# EAGLE schematic Doppler_LED_Controller (EAGLE 9.1.3)
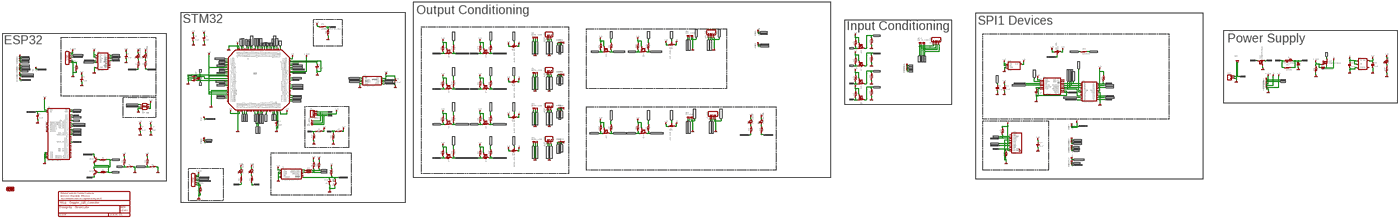
[diagram p0: schematic, sheet 1, overview]
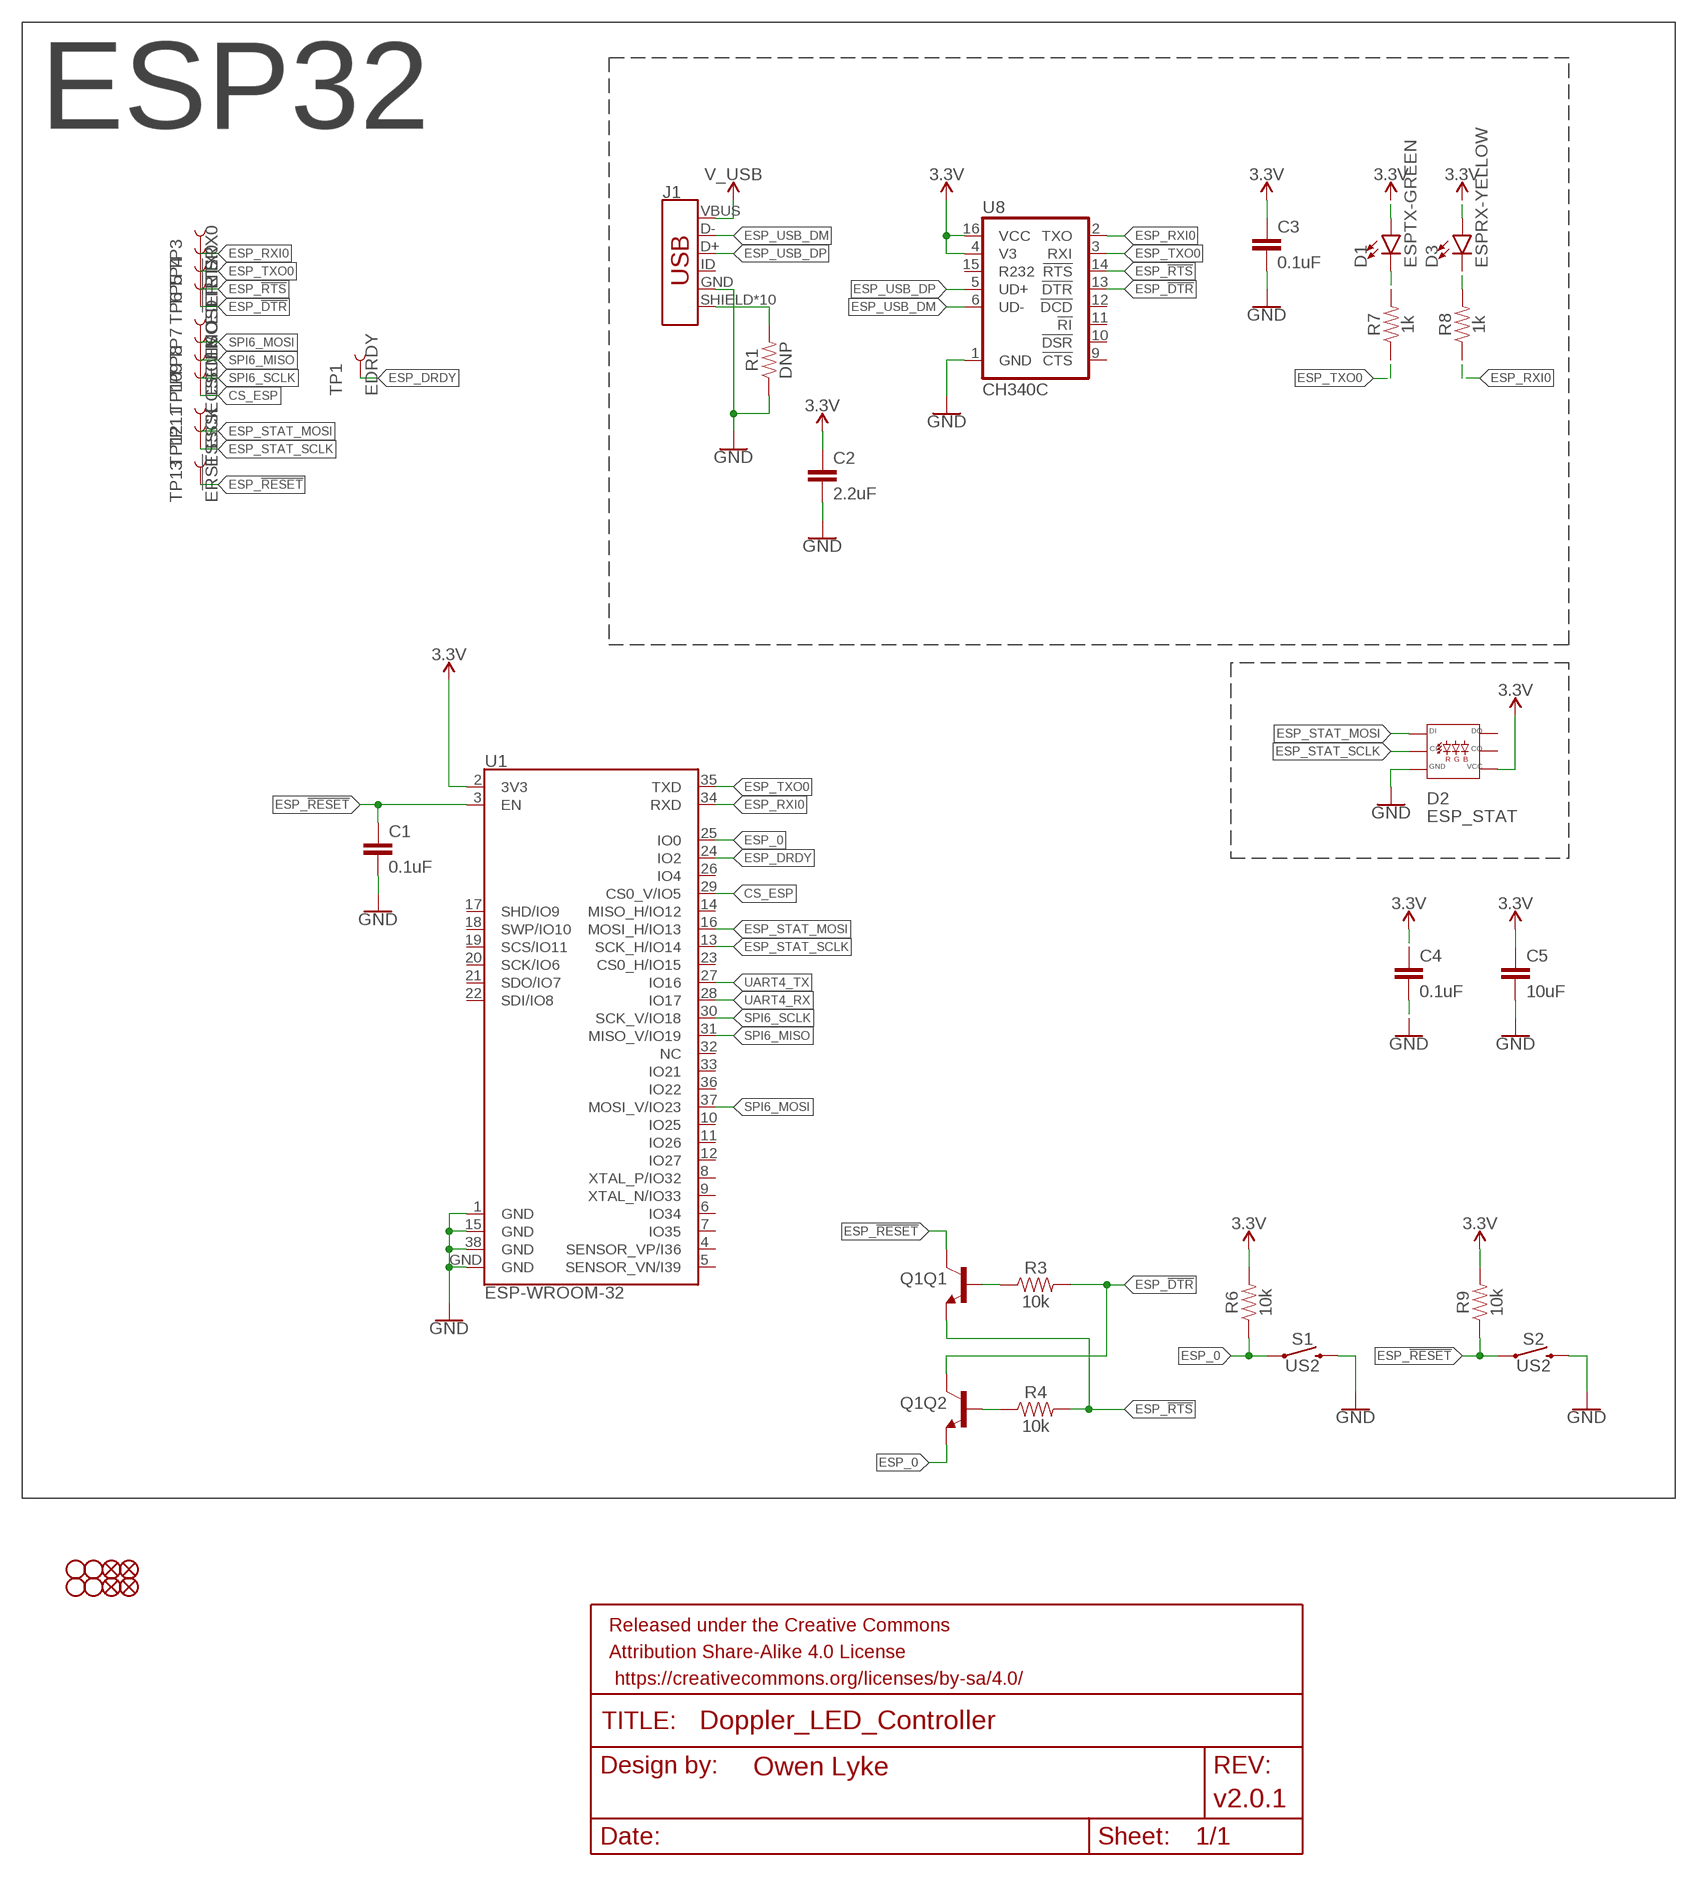
[diagram p1: schematic, sheet 1, part 1 of 6]
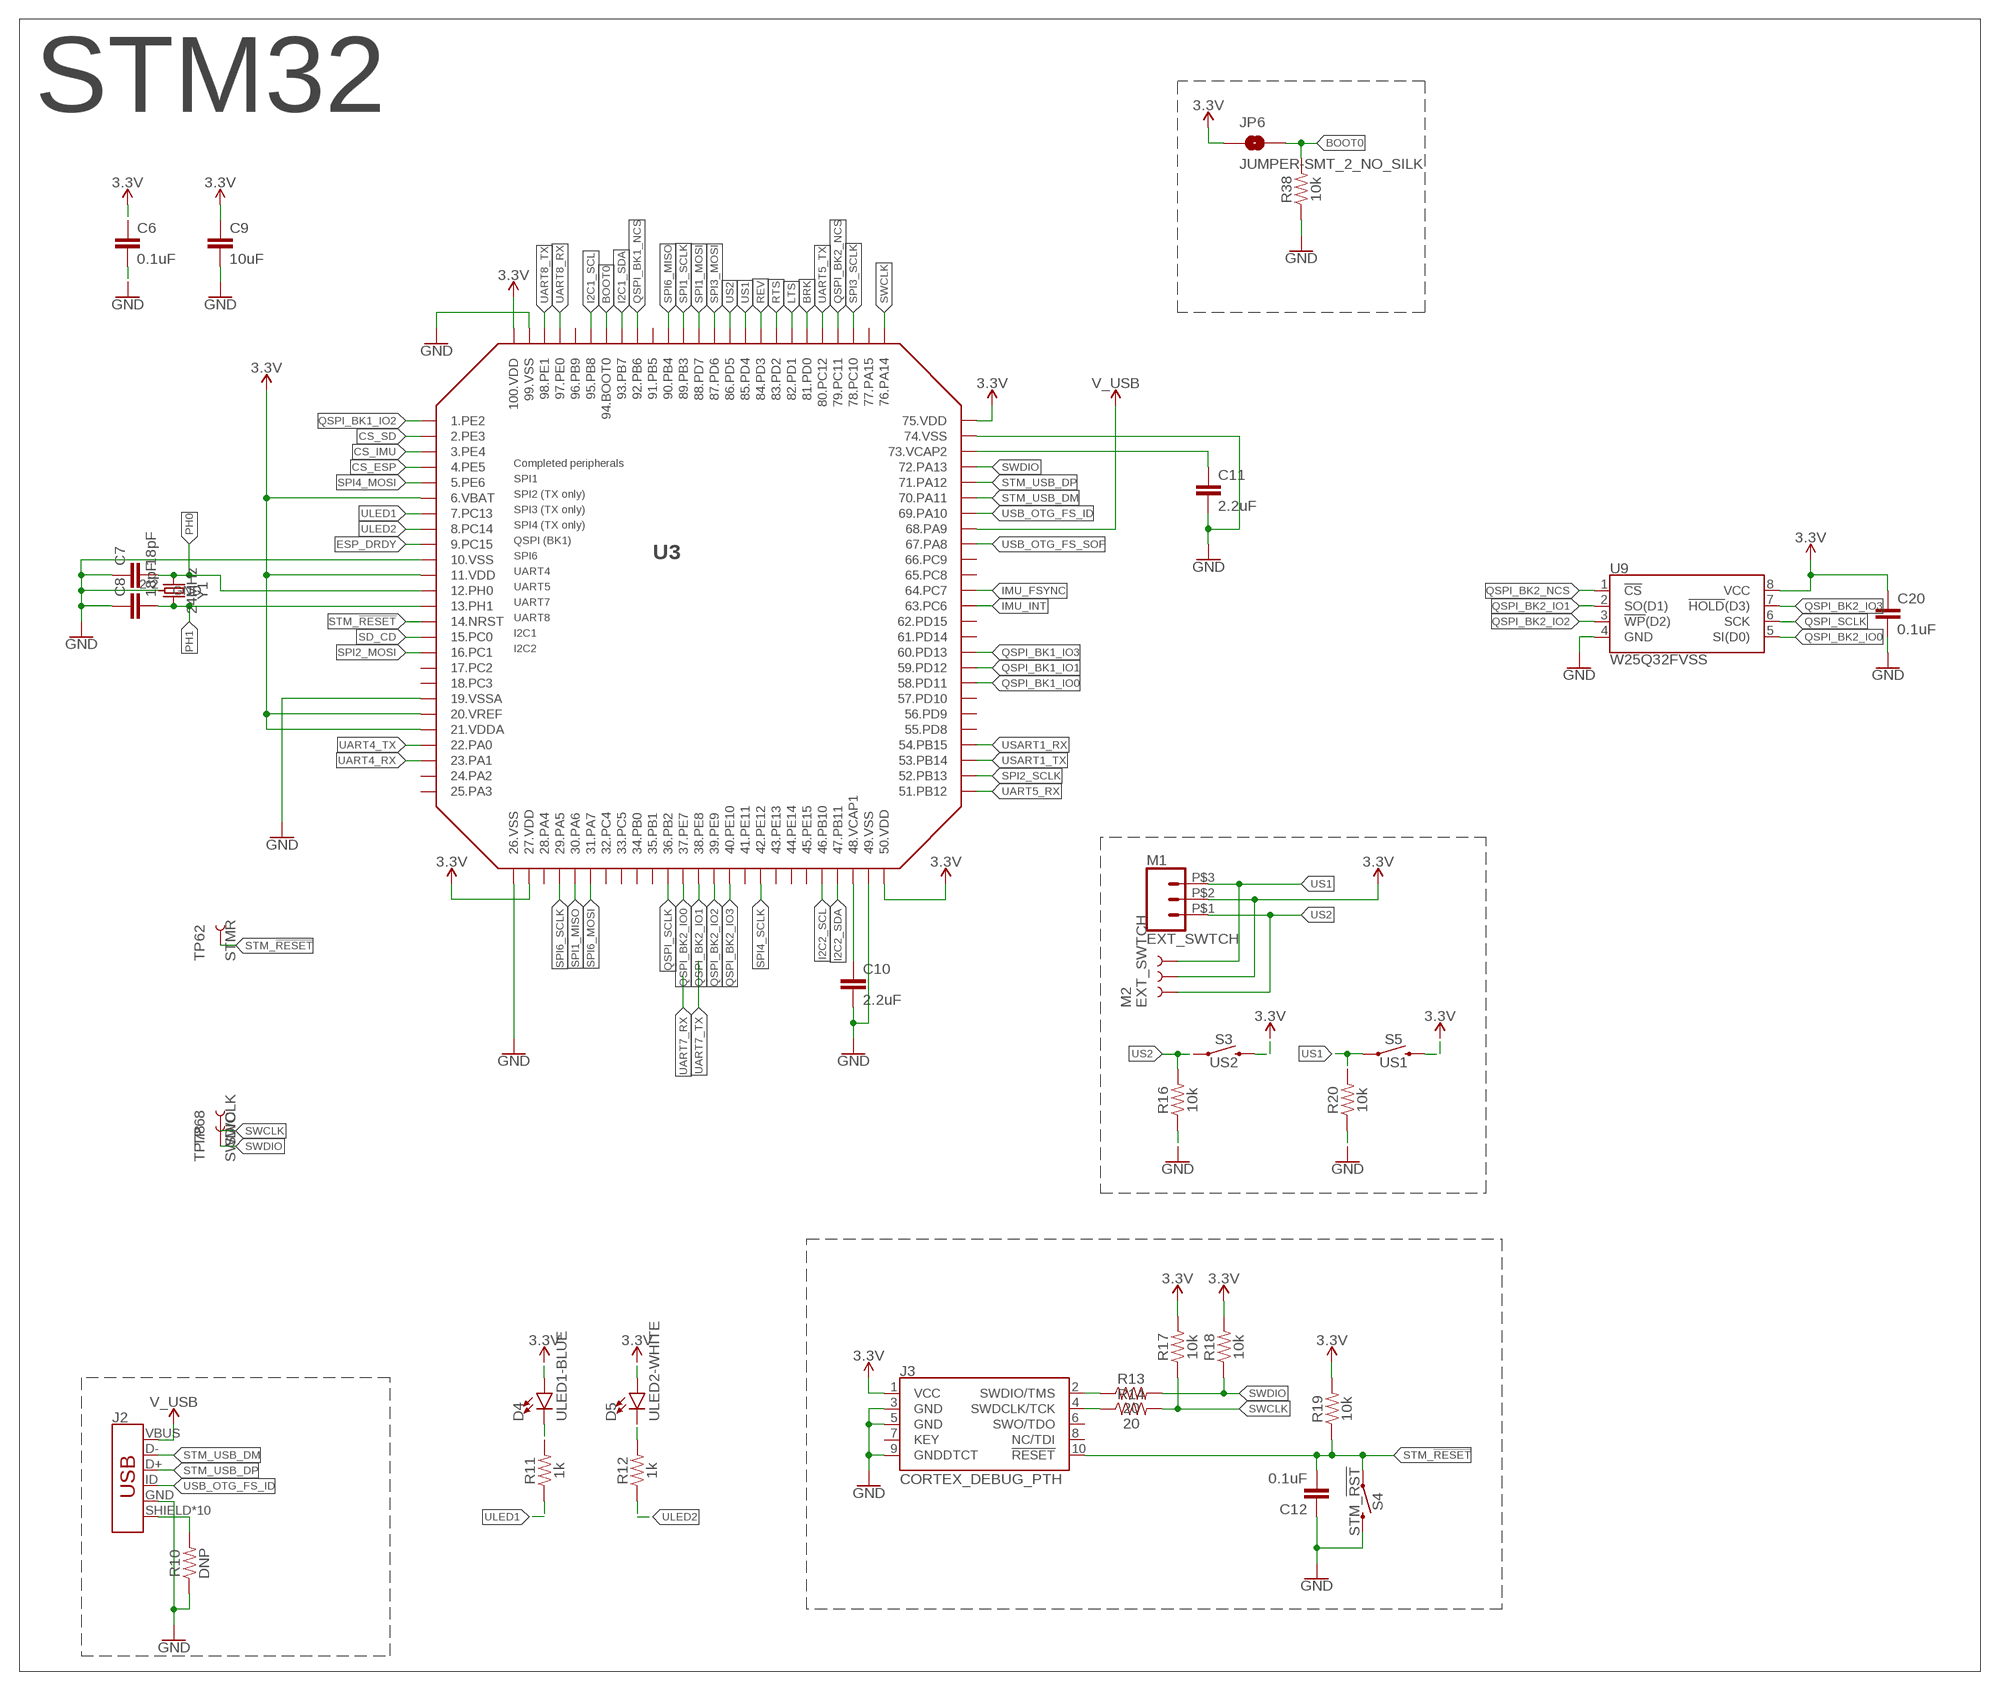
[diagram p2: schematic, sheet 1, part 2 of 6]
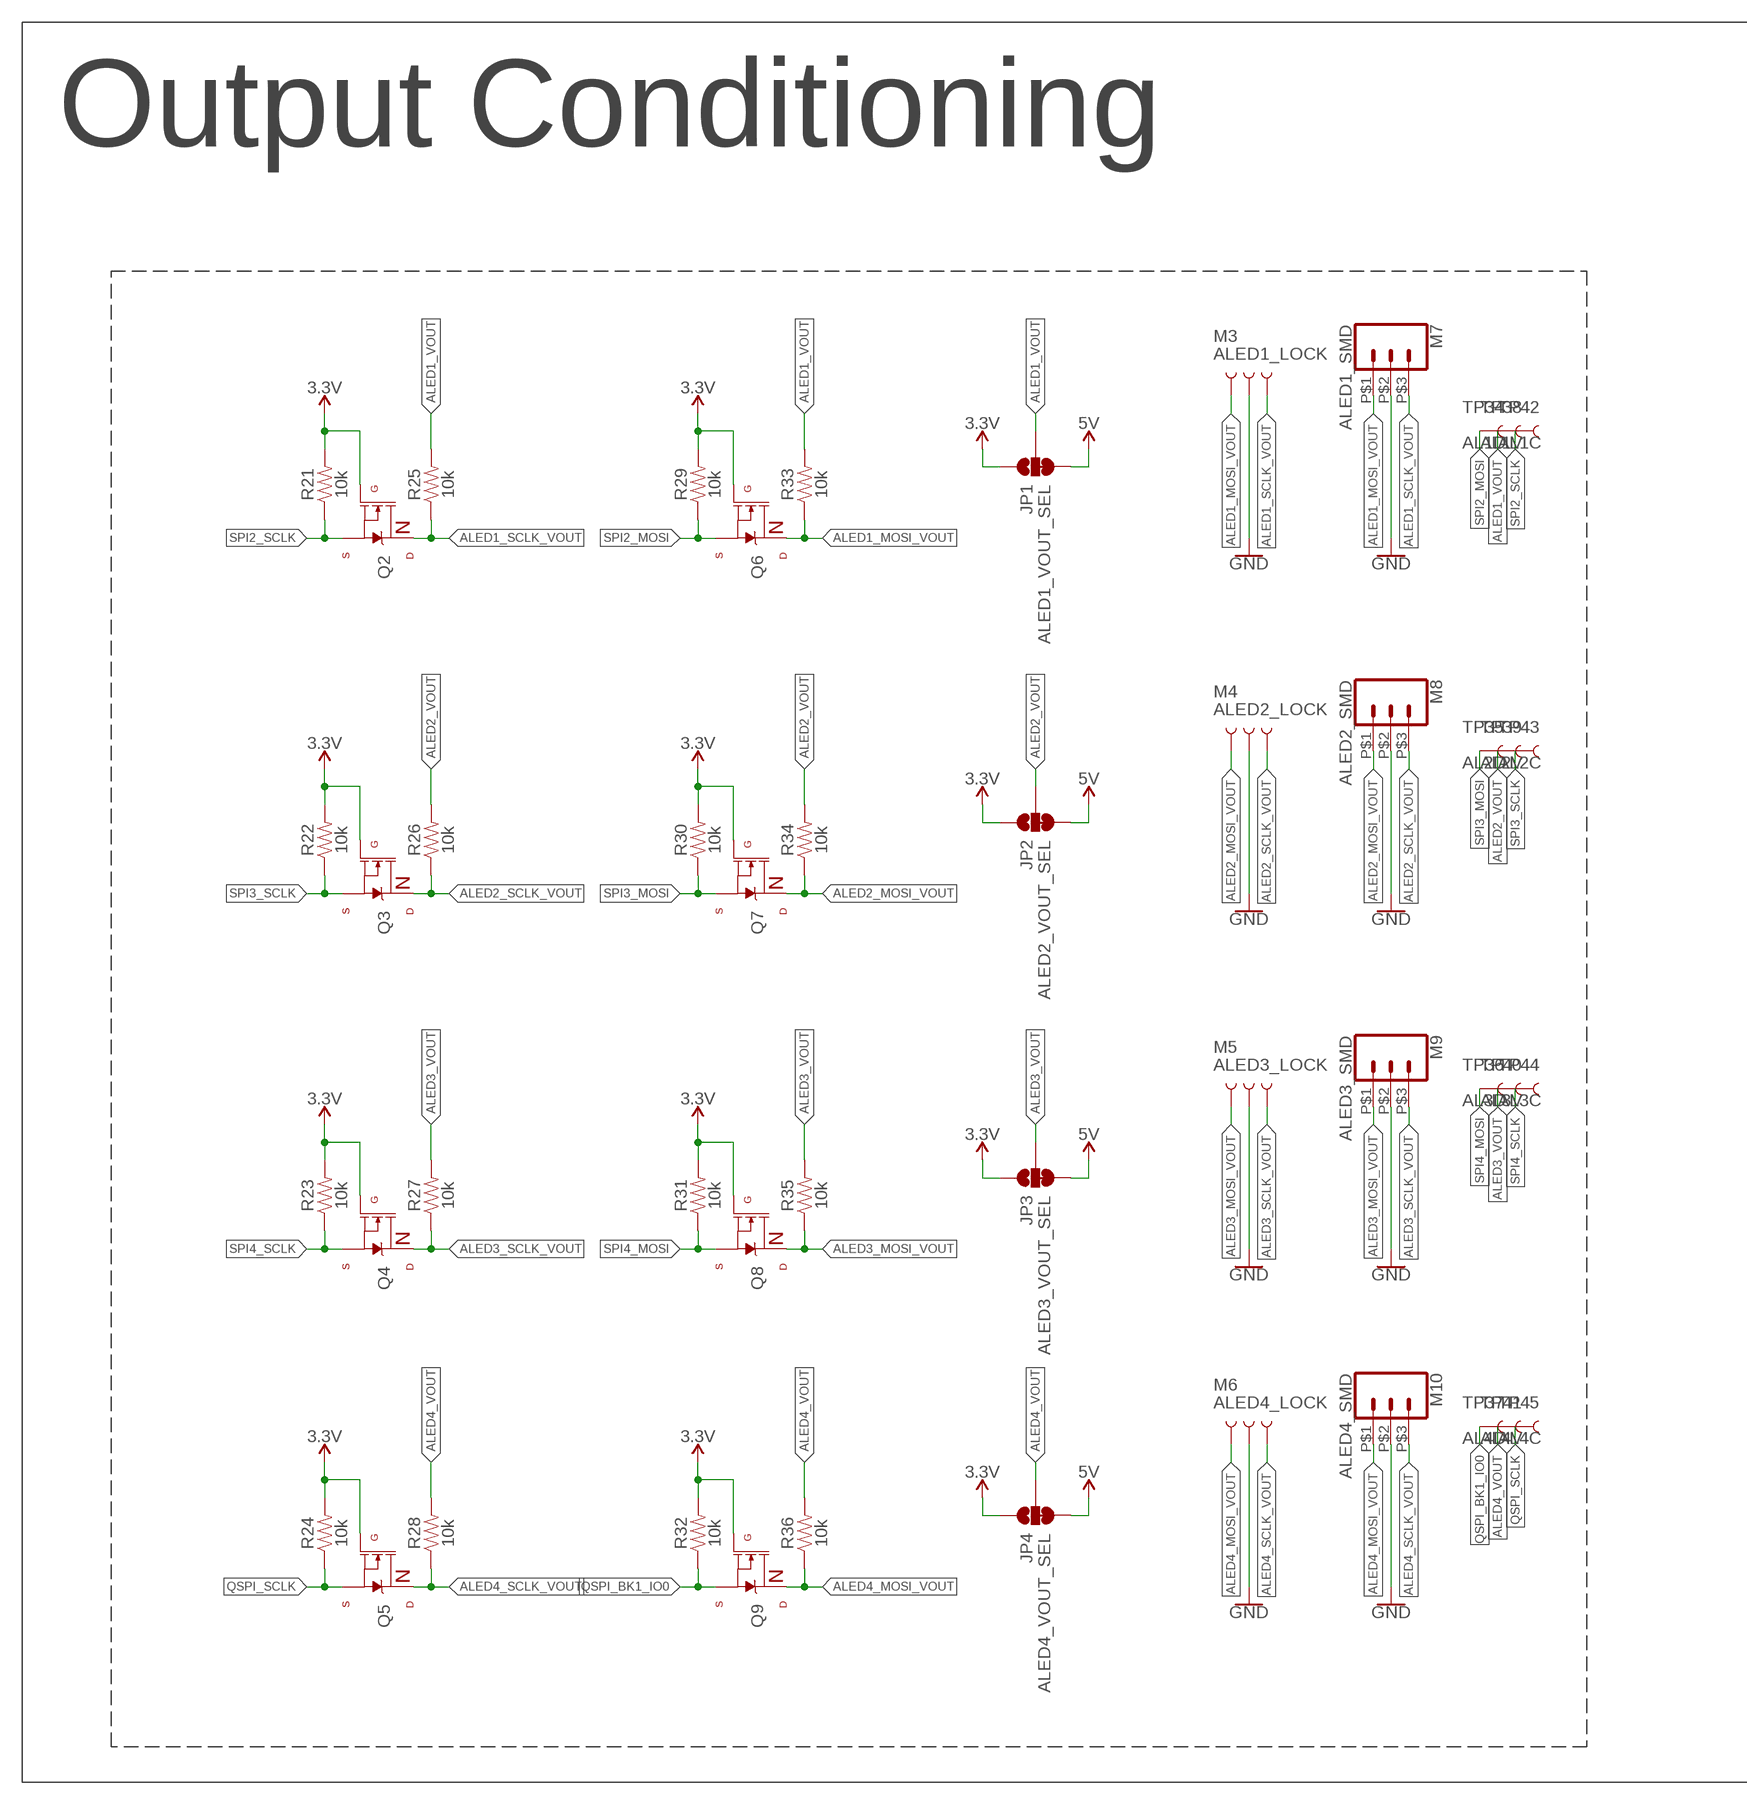
[diagram p3: schematic, sheet 1, part 3 of 6]
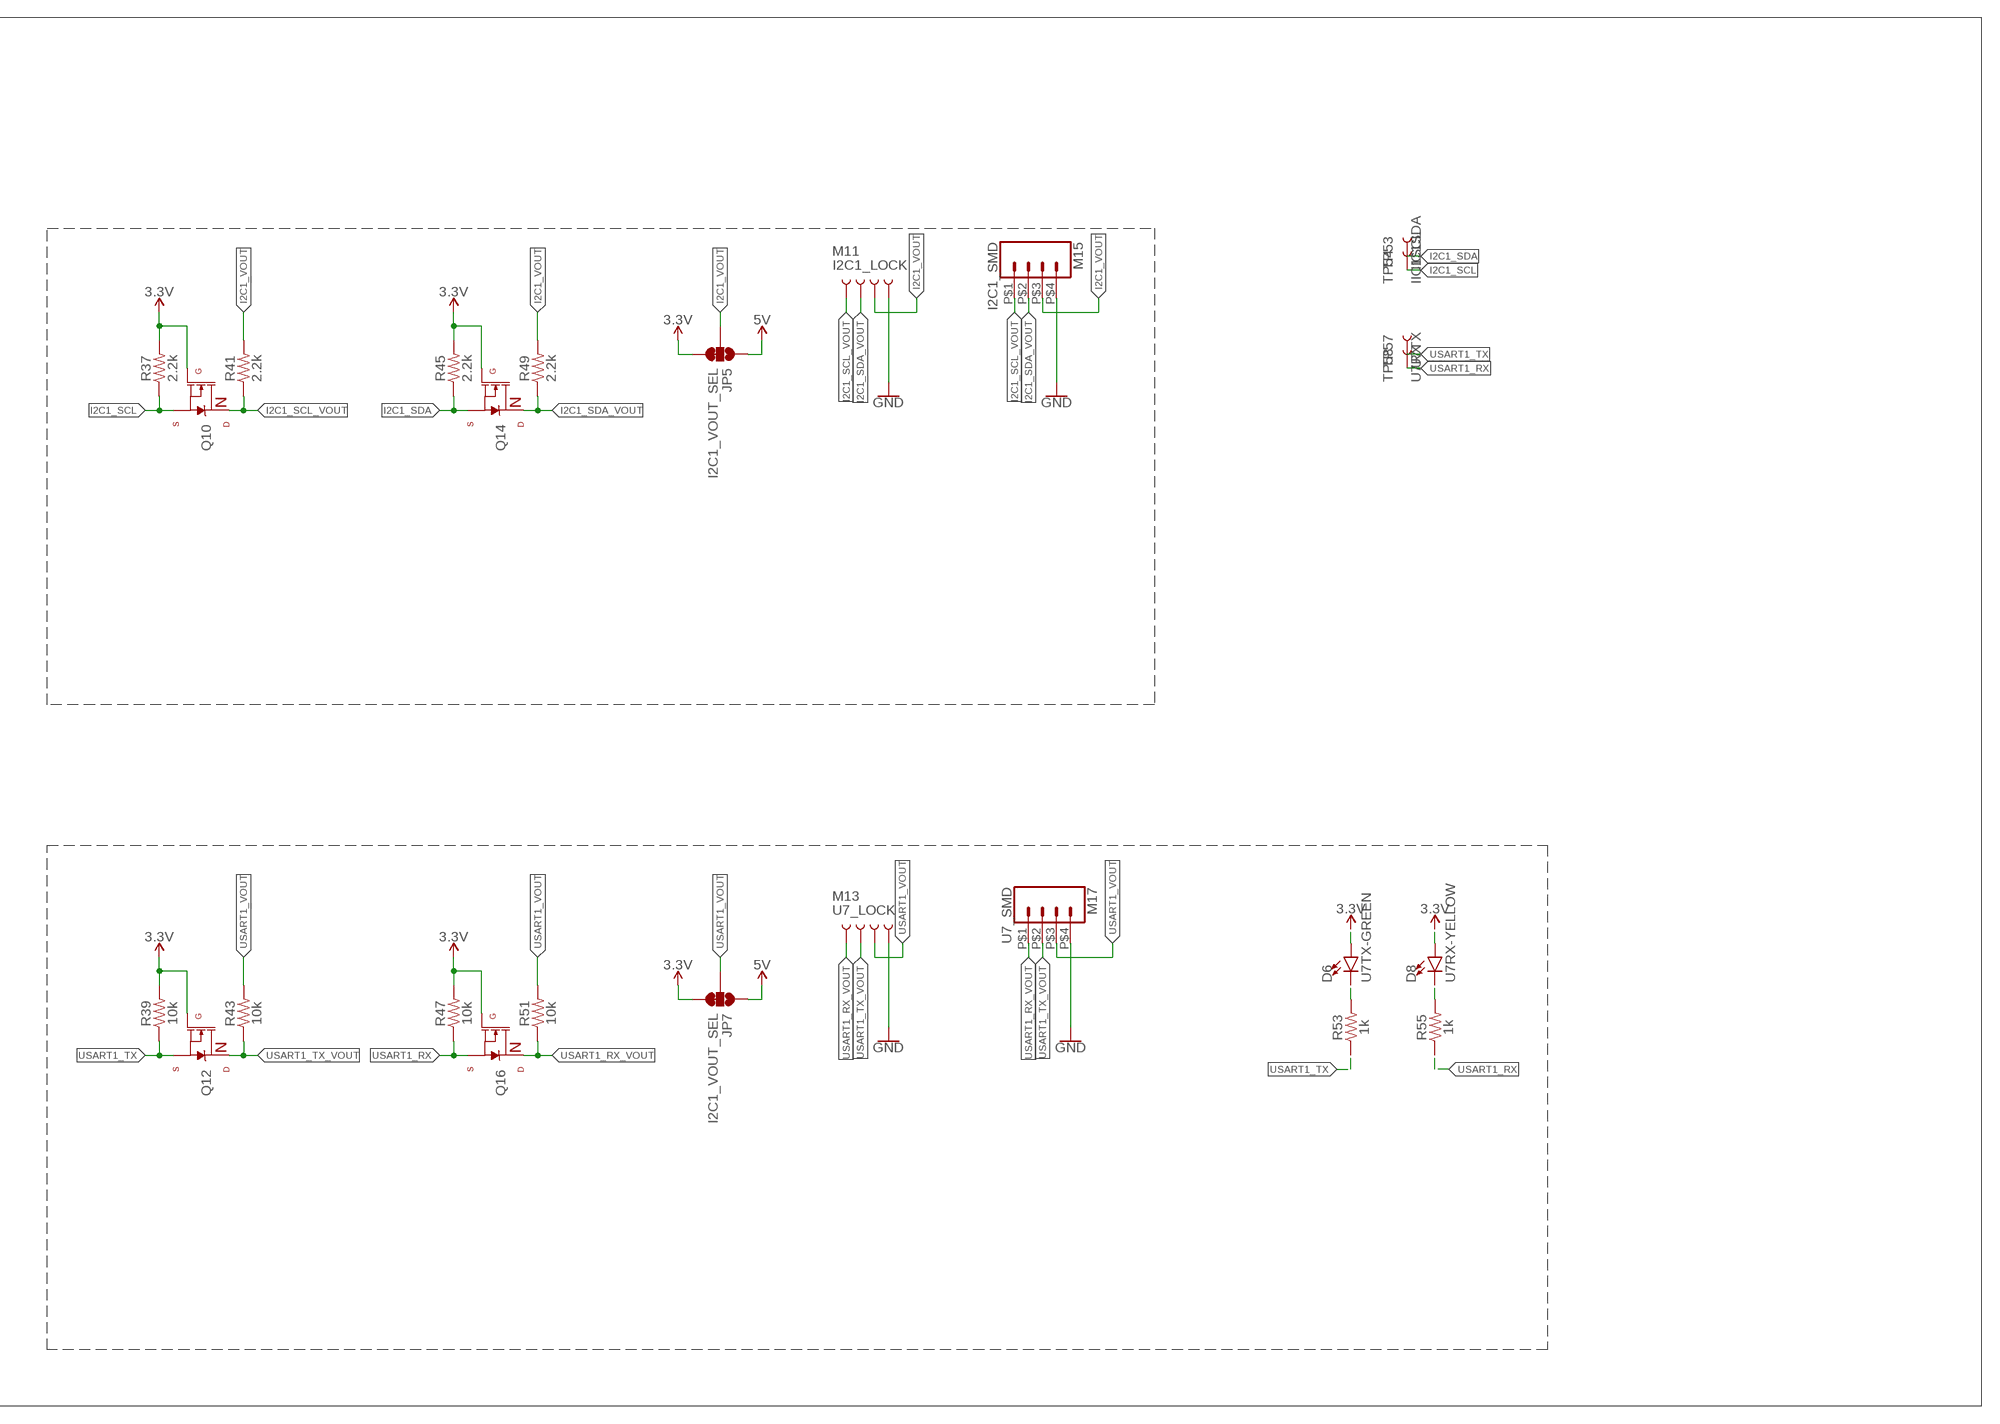
[diagram p4: schematic, sheet 1, part 4 of 6]
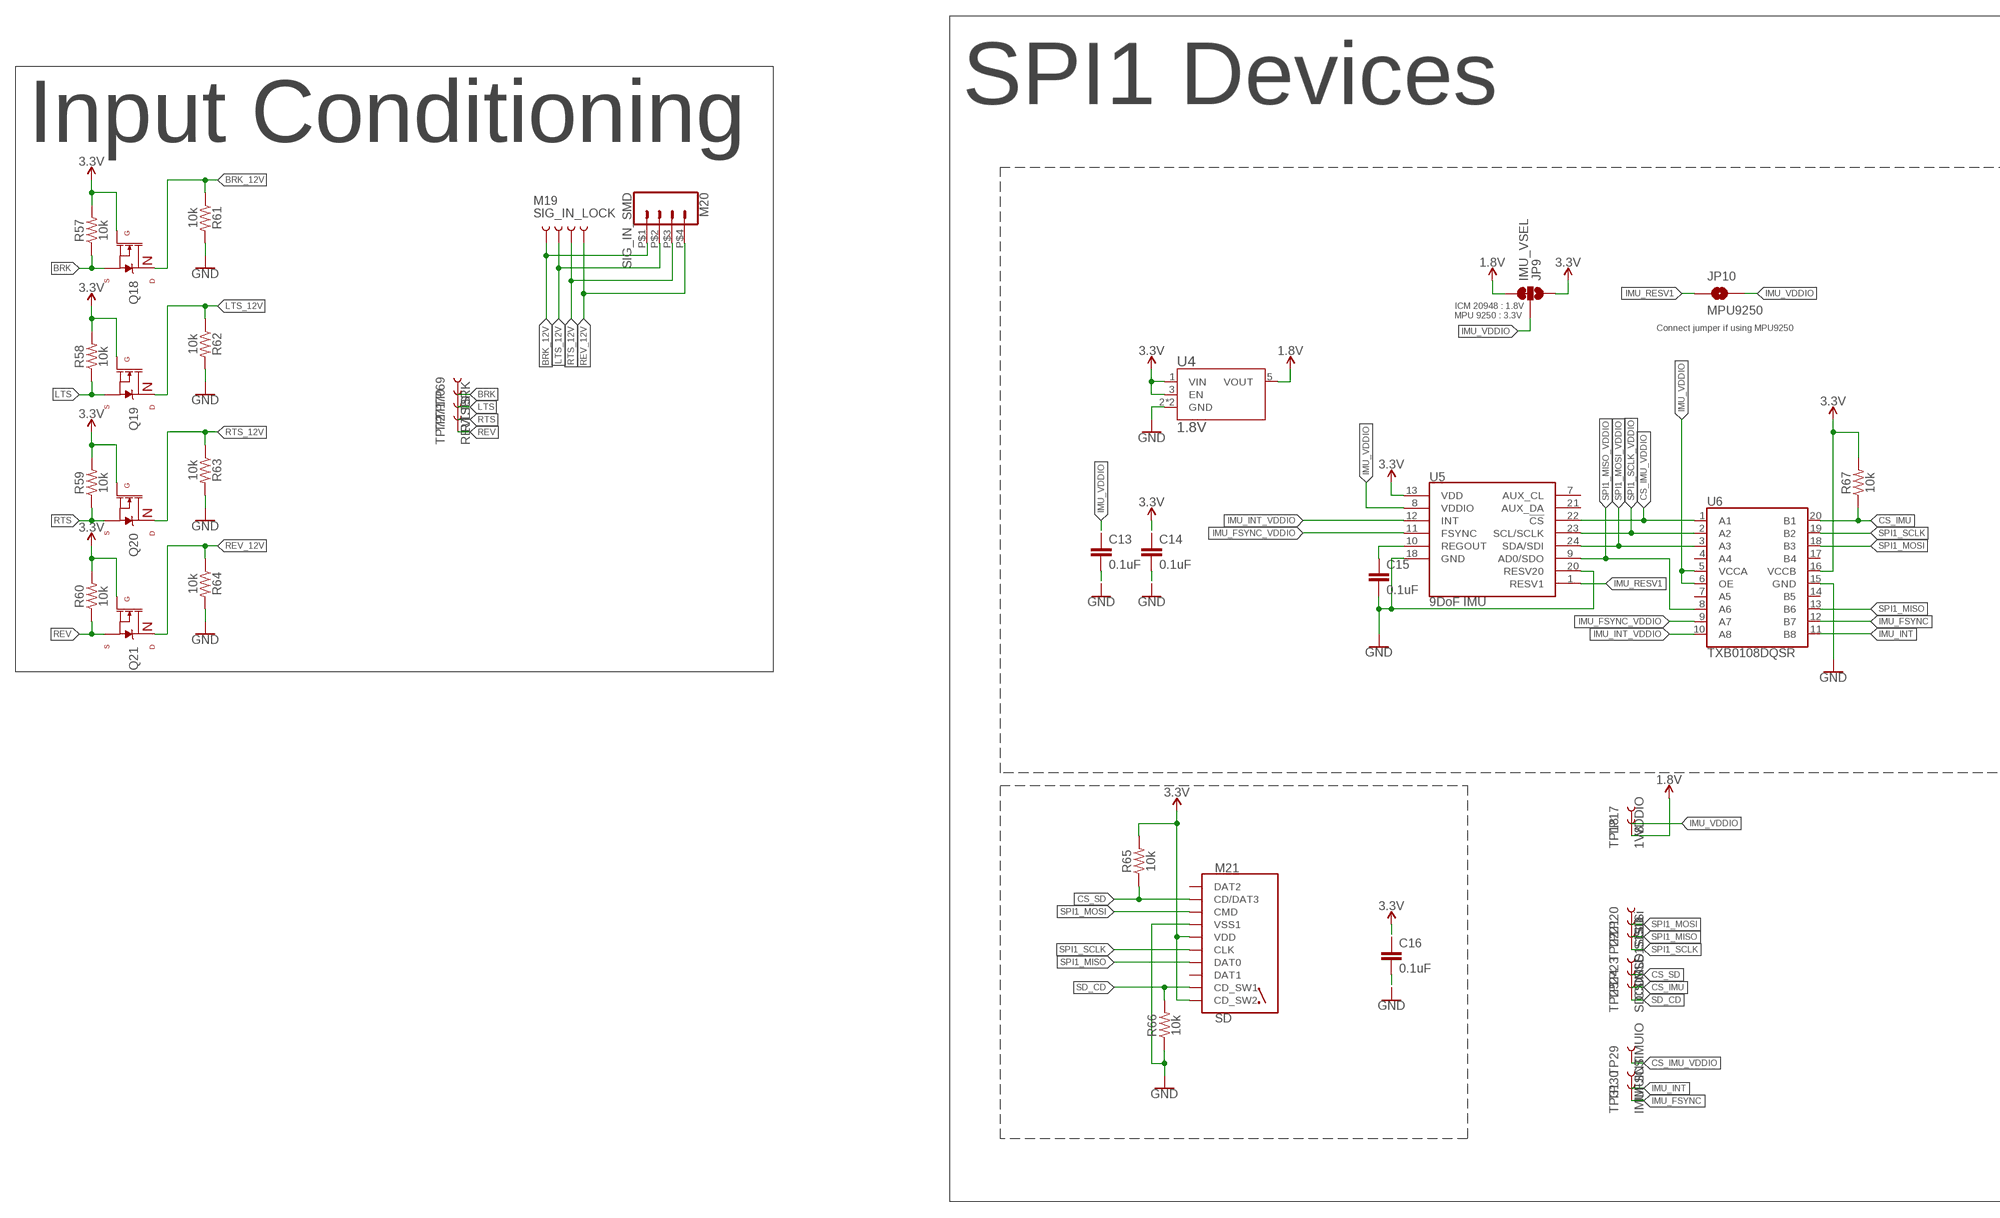
[diagram p5: schematic, sheet 1, part 5 of 6]
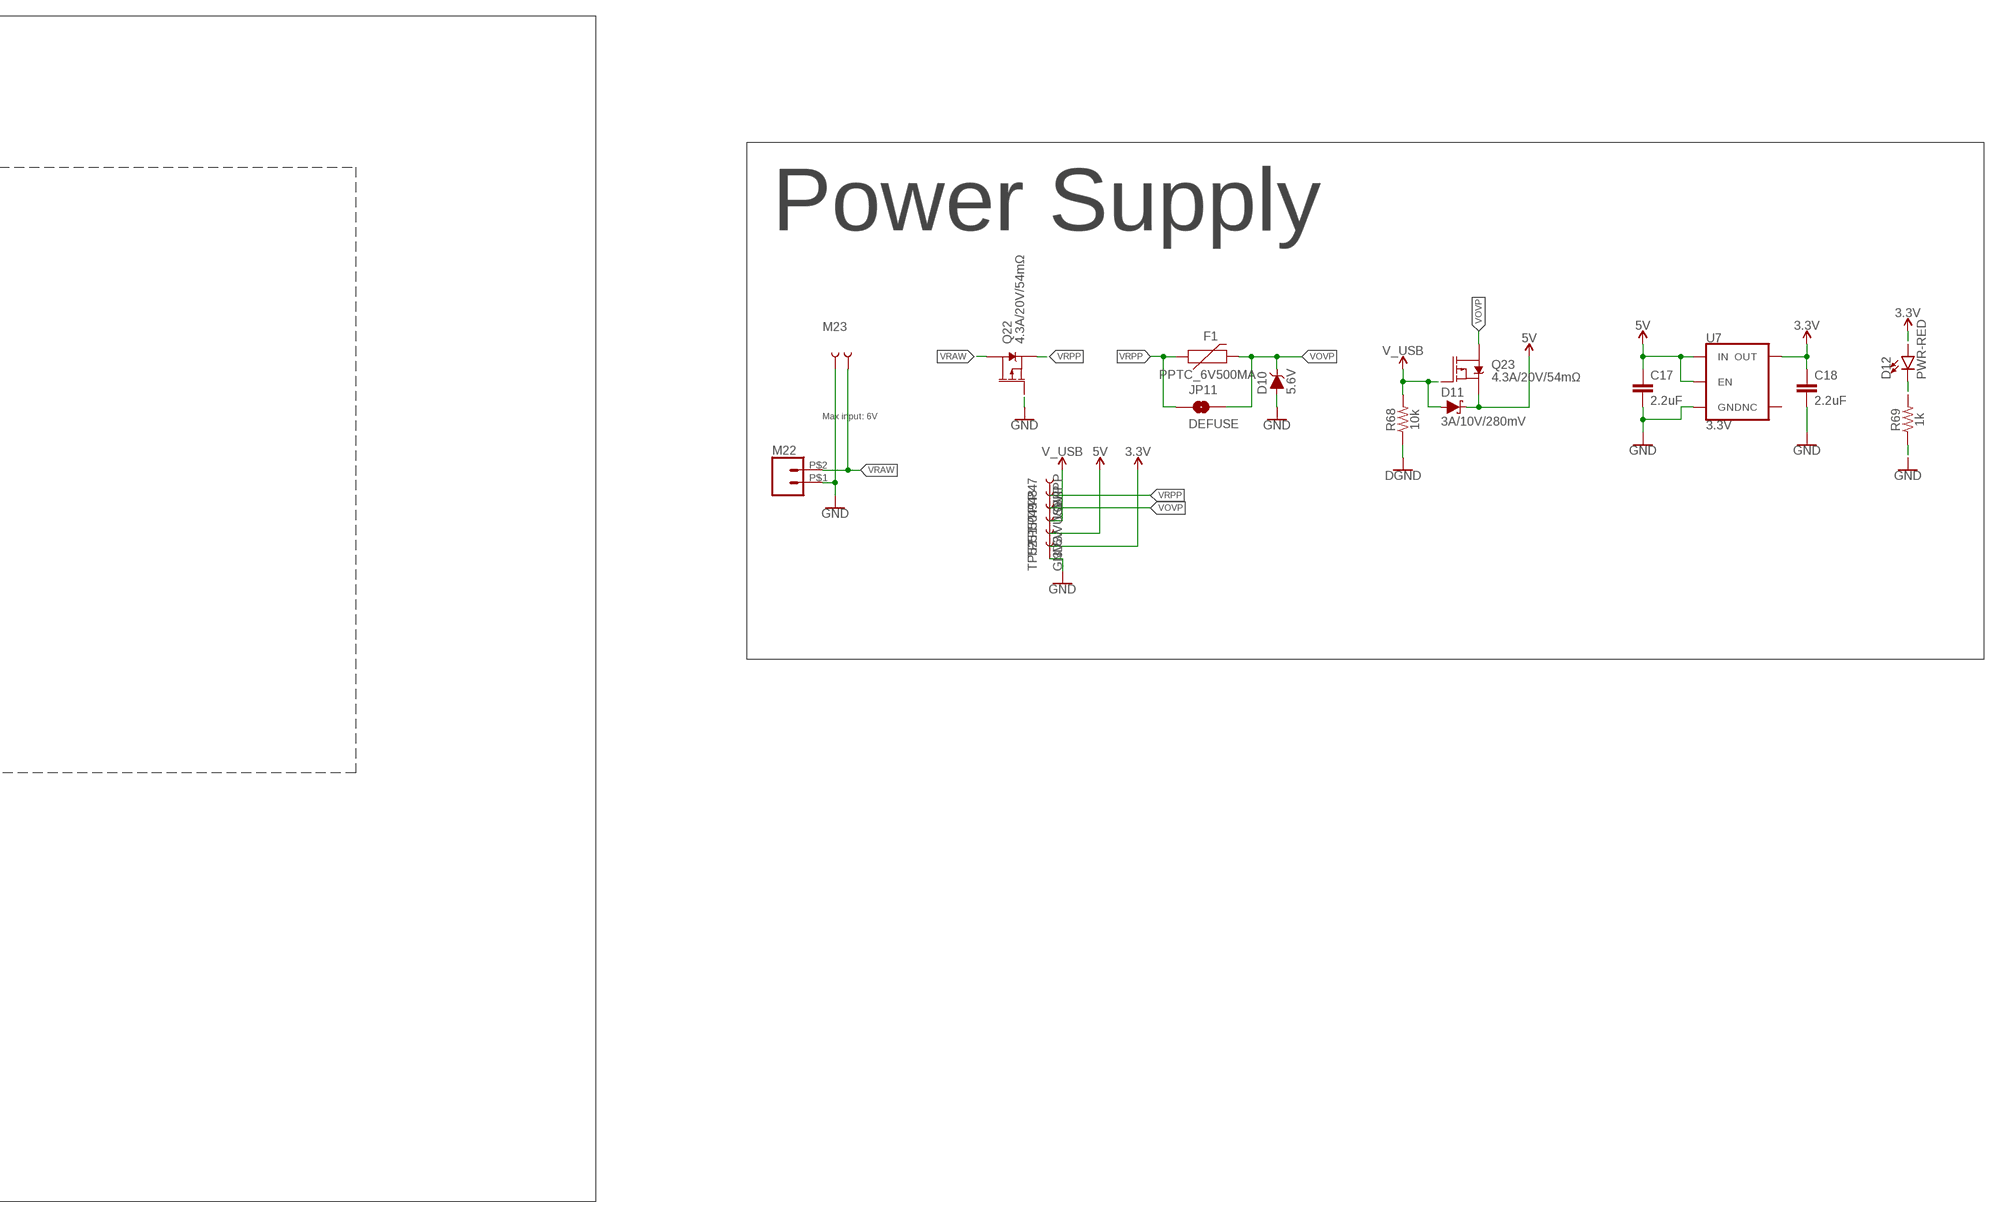
[diagram p6: schematic, sheet 1, part 6 of 6]

## Parts
C1  0.1uF  0.1UF-0603-25V-5%  [0603]
C2  2.2uF  2.2UF-0603-10V-20%  [0603]
C3  0.1uF  0.1UF-0603-25V-5%  [0603]
C4  0.1uF  0.1UF-0603-25V-5%  [0603]
C5  10uF  10UF-0603-6.3V-20%  [0603]
C6  0.1uF  0.1UF-0603-25V-5%  [0603]
C7  18pF  18PF-0603-50V-5%  [0603]
C8  18pF  18PF-0603-50V-5%  [0603]
C9  10uF  10UF-0603-6.3V-20%  [0603]
C10  2.2uF  2.2UF-0603-10V-20%  [0603]
C11  2.2uF  2.2UF-0603-10V-20%  [0603]
C12  0.1uF  0.1UF-0603-25V-5%  [0603]
C13  0.1uF  0.1UF-0603-25V-5%  [0603]
C14  0.1uF  0.1UF-0603-25V-5%  [0603]
C15  0.1uF  0.1UF-0603-25V-5%  [0603]
C16  0.1uF  0.1UF-0603-25V-5%  [0603]
C17  2.2uF  2.2UF-0603-10V-20%  [0603]
C18  2.2uF  2.2UF-0603-10V-20%  [0603]
C20  0.1uF  0.1UF-0603-25V-(+80/-20%)  [0603]
D1  ESPTX-GREEN  LED-GREEN0603  [LED-0603]
D2  ESP_STAT  APA1022020_LONG  [APA102_2020_LONG]
D3  ESPRX-YELLOW  LED-YELLOW0603  [LED-0603]
D4  ULED1-BLUE  LED-BLUE0603  [LED-0603]
D5  ULED2-WHITE  LED-WHITE0603  [LED-0603]
D6  U7TX-GREEN  LED-GREEN0603  [LED-0603]
D8  U7RX-YELLOW  LED-YELLOW0603  [LED-0603]
D10  5.6V  DIODE-ZENER-MMSZ5232BS  [SOD-323]
D11  3A/10V/280mV  DIODE-SCHOTTKY-BAT60A  [SOD-323]
D12  PWR-RED  LED-RED0603  [LED-0603]
F1  PPTC_6V500MA  [0805]
FD1  FIDUCIAL1X2  [FIDUCIAL-1X2]
FD2  FIDUCIAL1X2  [FIDUCIAL-1X2]
FD3  FIDUCIAL1X2  [FIDUCIAL-1X2]
FD4  FIDUCIAL1X2  [FIDUCIAL-1X2]
H1  STAND-OFF  [STAND-OFF]
H2  STAND-OFF  [STAND-OFF]
H3  STAND-OFF  [STAND-OFF]
H4  STAND-OFF  [STAND-OFF]
J1  USB_MICRO-B_HALF_PTH_MILL  [USB-MICROB-PTH-MILL]
J2  USB_MICRO-B_HALF_PTH_MILL  [USB-MICROB-PTH-MILL]
J3  CORTEX_DEBUG_PTH  [2X5-PTH-1.27MM]
JP1  ALED1_VOUT_SEL  JUMPER-SMT_3_1-NC_TRACE_SILK  [SMT-JUMPER_3_1-NC_TRACE_SILK]
JP2  ALED2_VOUT_SEL  JUMPER-SMT_3_1-NC_TRACE_SILK  [SMT-JUMPER_3_1-NC_TRACE_SILK]
JP3  ALED3_VOUT_SEL  JUMPER-SMT_3_1-NC_TRACE_SILK  [SMT-JUMPER_3_1-NC_TRACE_SILK]
JP4  ALED4_VOUT_SEL  JUMPER-SMT_3_1-NC_TRACE_SILK  [SMT-JUMPER_3_1-NC_TRACE_SILK]
JP5  I2C1_VOUT_SEL  JUMPER-SMT_3_1-NC_TRACE_SILK  [SMT-JUMPER_3_1-NC_TRACE_SILK]
JP6  JUMPER-SMT_2_NO_SILK  [SMT-JUMPER_2_NO_SILK]
JP7  I2C1_VOUT_SEL  JUMPER-SMT_3_1-NC_TRACE_SILK  [SMT-JUMPER_3_1-NC_TRACE_SILK]
JP9  IMU_VSEL  JUMPER-SMT_3_1-NC_TRACE_SILK  [SMT-JUMPER_3_1-NC_TRACE_SILK]
JP10  MPU9250  JUMPER-SMT_2_NO_SILK  [SMT-JUMPER_2_NO_SILK]
JP11  DEFUSE  JUMPER-SMT_2_NO_SILK  [SMT-JUMPER_2_NO_SILK]
M1  EXT_SWTCH  CONN_SMD_3  [1X03_SMD_0.1IN]
M2  EXT_SWTCH  CONN_LED_OUT-MOLEX_5055670371  [3_PIN_LOCK]
M3  ALED1_LOCK  CONN_LED_OUT-MOLEX_5055670371  [3_PIN_LOCK]
M4  ALED2_LOCK  CONN_LED_OUT-MOLEX_5055670371  [3_PIN_LOCK]
M5  ALED3_LOCK  CONN_LED_OUT-MOLEX_5055670371  [3_PIN_LOCK]
M6  ALED4_LOCK  CONN_LED_OUT-MOLEX_5055670371  [3_PIN_LOCK]
M7  ALED1_SMD  CONN_SMD_3  [1X03_SMD_0.1IN]
M8  ALED2_SMD  CONN_SMD_3  [1X03_SMD_0.1IN]
M9  ALED3_SMD  CONN_SMD_3  [1X03_SMD_0.1IN]
M10  ALED4_SMD  CONN_SMD_3  [1X03_SMD_0.1IN]
M11  I2C1_LOCK  CONN_LOCK_4-MOLEX_5055670471  [4_PIN_LOCK]
M13  U7_LOCK  CONN_LOCK_4-MOLEX_5055670471  [4_PIN_LOCK]
M15  I2C1_SMD  CONN_SMD_4  [1X04_SMD_0.1IN]
M17  U7_SMD  CONN_SMD_4  [1X04_SMD_0.1IN]
M19  SIG_IN_LOCK  CONN_LOCK_4-MOLEX_5055670471  [4_PIN_LOCK]
M20  SIG_IN_SMD  CONN_SMD_4  [1X04_SMD_0.1IN]
M21  SD  SD_MICRO_SOCKET-114-00841-68  [SD_AMPHENOL_PUSH_PULL]
M22  CONN_SMD_2  [1X02_SMD_0.1IN]
M23  CONN_LOCK_2-5055670271  [2_PIN_LOCK]
Q1  TRANS_NPN_DUAL-MBT3904DW1T1  [SC70-6]
Q2  AMP_MOSFET_NCH-2N7002K  [SOT23-3]
Q3  AMP_MOSFET_NCH-2N7002K  [SOT23-3]
Q4  AMP_MOSFET_NCH-2N7002K  [SOT23-3]
Q5  AMP_MOSFET_NCH-2N7002K  [SOT23-3]
Q6  AMP_MOSFET_NCH-2N7002K  [SOT23-3]
Q7  AMP_MOSFET_NCH-2N7002K  [SOT23-3]
Q8  AMP_MOSFET_NCH-2N7002K  [SOT23-3]
Q9  AMP_MOSFET_NCH-2N7002K  [SOT23-3]
Q10  AMP_MOSFET_NCH-2N7002K  [SOT23-3]
Q12  AMP_MOSFET_NCH-2N7002K  [SOT23-3]
Q14  AMP_MOSFET_NCH-2N7002K  [SOT23-3]
Q16  AMP_MOSFET_NCH-2N7002K  [SOT23-3]
Q18  AMP_MOSFET_NCH-2N7002K  [SOT23-3]
Q19  AMP_MOSFET_NCH-2N7002K  [SOT23-3]
Q20  AMP_MOSFET_NCH-2N7002K  [SOT23-3]
Q21  AMP_MOSFET_NCH-2N7002K  [SOT23-3]
Q22  4.3A/20V/54mΩ  MOSFET_PCH-IRLML2244  [SOT23-3]
Q23  4.3A/20V/54mΩ  MOSFET_PCH-IRLML2244  [SOT23-3]
R1  DNP  1MOHM-0603-1/4W-5%  [0603]
R3  10k  10KOHM-0603-1/10W-1%  [0603]
R4  10k  10KOHM-0603-1/10W-1%  [0603]
R6  10k  10KOHM-0603-1/10W-1%  [0603]
R7  1k  1KOHM-0603-1/10W-1%  [0603]
R8  1k  1KOHM-0603-1/10W-1%  [0603]
R9  10k  10KOHM-0603-1/10W-1%  [0603]
R10  DNP  1MOHM-0603-1/4W-5%  [0603]
R11  1k  1KOHM-0603-1/10W-1%  [0603]
R12  1k  1KOHM-0603-1/10W-1%  [0603]
R13  20  20OHM-0603-1/10W-1%  [0603]
R14  20  20OHM-0603-1/10W-1%  [0603]
R16  10k  10KOHM-0603-1/10W-1%  [0603]
R17  10k  10KOHM-0603-1/10W-1%  [0603]
R18  10k  10KOHM-0603-1/10W-1%  [0603]
R19  10k  10KOHM-0603-1/10W-1%  [0603]
R20  10k  10KOHM-0603-1/10W-1%  [0603]
R21  10k  10KOHM-0603-1/10W-1%  [0603]
R22  10k  10KOHM-0603-1/10W-1%  [0603]
R23  10k  10KOHM-0603-1/10W-1%  [0603]
R24  10k  10KOHM-0603-1/10W-1%  [0603]
R25  10k  10KOHM-0603-1/10W-1%  [0603]
R26  10k  10KOHM-0603-1/10W-1%  [0603]
R27  10k  10KOHM-0603-1/10W-1%  [0603]
R28  10k  10KOHM-0603-1/10W-1%  [0603]
R29  10k  10KOHM-0603-1/10W-1%  [0603]
R30  10k  10KOHM-0603-1/10W-1%  [0603]
R31  10k  10KOHM-0603-1/10W-1%  [0603]
R32  10k  10KOHM-0603-1/10W-1%  [0603]
R33  10k  10KOHM-0603-1/10W-1%  [0603]
R34  10k  10KOHM-0603-1/10W-1%  [0603]
R35  10k  10KOHM-0603-1/10W-1%  [0603]
R36  10k  10KOHM-0603-1/10W-1%  [0603]
R37  2.2k  2.2KOHM-0603-1/10W-1%  [0603]
R38  10k  10KOHM-0603-1/10W-1%  [0603]
R39  10k  10KOHM-0603-1/10W-1%  [0603]
R41  2.2k  2.2KOHM-0603-1/10W-1%  [0603]
R43  10k  10KOHM-0603-1/10W-1%  [0603]
R45  2.2k  2.2KOHM-0603-1/10W-1%  [0603]
R47  10k  10KOHM-0603-1/10W-1%  [0603]
R49  2.2k  2.2KOHM-0603-1/10W-1%  [0603]
R51  10k  10KOHM-0603-1/10W-1%  [0603]
R53  1k  1KOHM-0603-1/10W-1%  [0603]
R55  1k  1KOHM-0603-1/10W-1%  [0603]
R57  10k  10KOHM-0603-1/10W-1%  [0603]
R58  10k  10KOHM-0603-1/10W-1%  [0603]
R59  10k  10KOHM-0603-1/10W-1%  [0603]
R60  10k  10KOHM-0603-1/10W-1%  [0603]
R61  10k  10KOHM-0603-1/10W-1%  [0603]
R62  10k  10KOHM-0603-1/10W-1%  [0603]
R63  10k  10KOHM-0603-1/10W-1%  [0603]
R64  10k  10KOHM-0603-1/10W-1%  [0603]
R65  10k  10KOHM-0603-1/10W-1%  [0603]
R66  10k  10KOHM-0603-1/10W-1%  [0603]
R67  10k  10KOHM-0603-1/10W-1%  [0603]
R68  10k  10KOHM-0603-1/10W-1%  [0603]
R69  1k  1KOHM-0603-1/10W-1%  [0603]
S1  US2  MOMENTARY-SWITCH-SPST-SMD-5.2-REDUNDANT  [TACTILE_SWITCH_SMD_5.2MM]
S2  US2  MOMENTARY-SWITCH-SPST-SMD-5.2-REDUNDANT  [TACTILE_SWITCH_SMD_5.2MM]
S3  US2  MOMENTARY-SWITCH-SPST-SMD-5.2-REDUNDANT  [TACTILE_SWITCH_SMD_5.2MM]
S4  STM_!RST  MOMENTARY-SWITCH-SPST-SMD-5.2-REDUNDANT  [TACTILE_SWITCH_SMD_5.2MM]
S5  US1  MOMENTARY-SWITCH-SPST-SMD-5.2-REDUNDANT  [TACTILE_SWITCH_SMD_5.2MM]
TP1  EDRDY  TEST-POINT3X4  [PAD.03X.04]
TP3  ERX0  TEST-POINT3X4  [PAD.03X.04]
TP4  ETX0  TEST-POINT3X4  [PAD.03X.04]
TP5  E!RTS  TEST-POINT3X4  [PAD.03X.04]
TP6  E!DTR  TEST-POINT3X4  [PAD.03X.04]
TP7  EMOSI  TEST-POINT3X4  [PAD.03X.04]
TP8  EMISO  TEST-POINT3X4  [PAD.03X.04]
TP9  ESCLK  TEST-POINT3X4  [PAD.03X.04]
TP10  ECS  TEST-POINT3X4  [PAD.03X.04]
TP11  ESSI  TEST-POINT3X4  [PAD.03X.04]
TP12  ESSCK  TEST-POINT3X4  [PAD.03X.04]
TP13  E!RST  TEST-POINT3X4  [PAD.03X.04]
TP17  VDDIO  TEST-POINT3X4  [PAD.03X.04]
TP18  1V8  TEST-POINT3X4  [PAD.03X.04]
TP20  S1Si  TEST-POINT3X4  [PAD.03X.04]
TP21  S1SO  TEST-POINT3X4  [PAD.03X.04]
TP22  S1SCLk  TEST-POINT3X4  [PAD.03X.04]
TP23  CSSD  TEST-POINT3X4  [PAD.03X.04]
TP24  CSIMU  TEST-POINT3X4  [PAD.03X.04]
TP25  SDCD  TEST-POINT3X4  [PAD.03X.04]
TP29  CSIMUIO  TEST-POINT3X4  [PAD.03X.04]
TP30  IMUINT  TEST-POINT3X4  [PAD.03X.04]
TP31  IMUFS  TEST-POINT3X4  [PAD.03X.04]
TP34  AL1D  TEST-POINT3X4  [PAD.03X.04]
TP35  AL2D  TEST-POINT3X4  [PAD.03X.04]
TP36  AL3D  TEST-POINT3X4  [PAD.03X.04]
TP37  AL4D  TEST-POINT3X4  [PAD.03X.04]
TP38  AL1V  TEST-POINT3X4  [PAD.03X.04]
TP39  AL2V  TEST-POINT3X4  [PAD.03X.04]
TP40  AL3V  TEST-POINT3X4  [PAD.03X.04]
TP41  AL4V  TEST-POINT3X4  [PAD.03X.04]
TP42  AL1C  TEST-POINT3X4  [PAD.03X.04]
TP43  AL2C  TEST-POINT3X4  [PAD.03X.04]
TP44  AL3C  TEST-POINT3X4  [PAD.03X.04]
TP45  AL4C  TEST-POINT3X4  [PAD.03X.04]
TP47  VRPP  TEST-POINT3X4  [PAD.03X.04]
TP48  VOVP  TEST-POINT3X4  [PAD.03X.04]
TP49  VUSB  TEST-POINT3X4  [PAD.03X.04]
TP50  5V  TEST-POINT3X4  [PAD.03X.04]
TP51  3V3  TEST-POINT3X4  [PAD.03X.04]
TP52  GND  TEST-POINT3X4  [PAD.03X.04]
TP53  IIC1SDA  TEST-POINT3X4  [PAD.03X.04]
TP54  IIC1SCL  TEST-POINT3X4  [PAD.03X.04]
TP57  U7TX  TEST-POINT3X4  [PAD.03X.04]
TP58  U7RX  TEST-POINT3X4  [PAD.03X.04]
TP62  STMR  TEST-POINT3X4  [PAD.03X.04]
TP68  SWCLK  TEST-POINT3X4  [PAD.03X.04]
TP69  BRK  TEST-POINT3X4  [PAD.03X.04]
TP70  LTS  TEST-POINT3X4  [PAD.03X.04]
TP71  RTS  TEST-POINT3X4  [PAD.03X.04]
TP72  REV  TEST-POINT3X4  [PAD.03X.04]
TP78  SWDIO  TEST-POINT3X4  [PAD.03X.04]
U1  ESP-WROOM-32  [ESP-WROOM-32]
U3  STM32F765VTG6  [LQFP-100]
U4  1.8V  VREG_1.8_TPS78218DDCR  [DDC5]
U5  9DoF IMU  IMU_MPU9250-ICM20948  [QFN24-3X3]
U6  TXB0108DQSR  TXB0108  [UFDFN-20]
U7  3.3V  V_REG_AP2112K-3.3V  [SOT23-5]
U8  CH340C  [SO016]
U9  W25Q32FVSS  [SOIC-8]
U$98  REV_NUM  [REV_NUM]
Y1  24MHz  CRYSTAL-24MHZ"  [CRYSTAL-SMD-5X3.2-4PAD]

## Nets
1.8V: JP9.3 TP18.P$1 U4.5(VOUT)
3.3V: C2.1 C3.1 C4.1 C5.1 C6.1 C9.1 C14.1 C16.1 C18.1 C20.1 D1.A D2.4VCC D3.A D4.A D5.A D6.A D8.A D12.A J3.1(VCC) JP1.1 JP2.1 JP3.1 JP4.1 JP5.3 JP6.1 JP7.3 JP9.1 M1.P$2 M2.P$2 M21.CD_SW2 M21.P$4(VDD) Q2.1(G) Q3.1(G) Q4.1(G) Q5.1(G) Q6.1(G) Q7.1(G) Q8.1(G) Q9.1(G) Q10.1(G) Q12.1(G) Q14.1(G) Q16.1(G) Q18.1(G) Q19.1(G) Q20.1(G) Q21.1(G) R6.2 R9.2 R17.2 R18.2 R19.2 R21.2 R22.2 R23.2 R24.2 R29.2 R30.2 R31.2 R32.2 R37.2 R39.2 R45.2 R47.2 R57.2 R58.2 R59.2 R60.2 R65.2 R67.2 S3.3 S3.4 S5.3 S5.4 TP51.P$1 U1.2(3V3) U3.P$6(6.VBAT) U3.P$11(11.VDD) U3.P$20(20.VREF) U3.P$21(21.VDDA) U3.P$27(27.VDD) U3.P$50(50.VDD) U3.P$75(75.VDD) U3.P$100(100.VDD) U4.1(VIN) U4.3(EN) U5.13(VDD) U6.16(VCCB) U7.5(OUT) U8.4(V3) U8.16(VCC) U9.8(VCC)
5V: C17.1 D11.C JP1.3 JP2.3 JP3.3 JP4.3 JP5.1 JP7.1 Q23.2(S) TP50.P$1 U7.1(IN) U7.3(EN)
ALED1_MOSI_VOUT: M3.P$1 M7.P$1 Q6.3(D) R33.1
ALED1_SCLK_VOUT: M3.P$3 M7.P$3 Q2.3(D) R25.1
ALED1_VOUT: JP1.2 R25.2 R33.2 TP38.P$1
ALED2_MOSI_VOUT: M4.P$1 M8.P$1 Q7.3(D) R34.1
ALED2_SCLK_VOUT: M4.P$3 M8.P$3 Q3.3(D) R26.1
ALED2_VOUT: JP2.2 R26.2 R34.2 TP39.P$1
ALED3_MOSI_VOUT: M5.P$1 M9.P$1 Q8.3(D) R35.1
ALED3_SCLK_VOUT: M5.P$3 M9.P$3 Q4.3(D) R27.1
ALED3_VOUT: JP3.2 R27.2 R35.2 TP40.P$1
ALED4_MOSI_VOUT: M6.P$1 M10.P$1 Q9.3(D) R36.1
ALED4_SCLK_VOUT: M6.P$3 M10.P$3 Q5.3(D) R28.1
ALED4_VOUT: JP4.2 R28.2 R36.2 TP41.P$1
BOOT0: JP6.2 R38.2 U3.P$94(94.BOOT0)
BRK: Q18.2(S) R57.1 TP69.P$1 U3.P$81(81.PD0)
BRK_12V: M19.P$1 M20.P$1 Q18.3(D) R61.1
CS_ESP: TP10.P$1 U1.29(CS0_V/IO5) U3.P$4(4.PE5)
CS_IMU: R67.1 TP24.P$1 U3.P$3(3.PE4) U6.20(B1)
CS_IMU_VDDIO: TP29.P$1 U5.22(!CS) U6.1(A1)
CS_SD: M21.P$2(CD/DAT3) R65.1 TP23.P$1 U3.P$2(2.PE3)
ESP_0: Q1.1(Q2:E) R6.1 S1.1 S1.2 U1.25(IO0)
ESP_!DTR: Q1.6(Q2:C) R3.2 TP6.P$1 U8.13(!DTR)
ESP_!RESET: C1.1 Q1.3(Q1:C) R9.1 S2.1 S2.2 TP13.P$1 U1.3(EN)
ESP_!RTS: Q1.4(Q1:E) R4.2 TP5.P$1 U8.14(!RTS)
ESP_DRDY: TP1.P$1 U1.24(IO2) U3.P$9(9.PC15)
ESP_RXI0: R8.1 TP3.P$1 U1.34(RXD) U8.2(TXO)
ESP_STAT_MOSI: D2.1DIN TP11.P$1 U1.16(MOSI_H/IO13)
ESP_STAT_SCLK: D2.2CIN TP12.P$1 U1.13(SCK_H/IO14)
ESP_TXO0: R7.1 TP4.P$1 U1.35(TXD) U8.3(RXI)
ESP_USB_DM: J1.D- U8.6(UD-)
ESP_USB_DP: J1.D+ U8.5(UD+)
GND: C1.2 C2.2 C3.2 C4.2 C5.2 C6.2 C7.1 C8.1 C9.2 C10.2 C11.2 C12.1 C13.2 C14.2 C15.2 C16.2 C17.2 C18.2 C20.2 D2.3GND D10.A J1.GND J2.GND J3.3(GND) J3.5(GND) J3.9(GNDDTCT) M3.P$2 M4.P$2 M5.P$2 M6.P$2 M7.P$2 M8.P$2 M9.P$2 M10.P$2 M11.P$4 M13.P$4 M15.P$4 M17.P$4 M21.P$6(VSS1) M22.P$1 M23.P$2 Q22.1(G) R1.1 R10.1 R16.1 R20.1 R38.1 R61.2 R62.2 R63.2 R64.2 R66.1 R68.1 R69.1 S1.3 S1.4 S2.3 S2.4 S4.3 S4.4 TP52.P$1 U1.1(GND) U1.15(GND) U1.38(GND) U1.GND U3.P$10(10.VSS) U3.P$19(19.VSSA) U3.P$26(26.VSS) U3.P$49(49.VSS) U3.P$74(74.VSS) U3.P$99(99.VSS) U4.2(GND) U4.4(GND) U5.18(GND) U5.20(RESV20) U6.15(GND) U7.2(GND) U8.1(GND) U9.4(GND) Y1.2(GND) Y1.4(GND) ; supply symbol labelled DGND
I2C1_SCL: Q10.2(S) R37.1 TP54.P$1 U3.P$95(95.PB8)
I2C1_SCL_VOUT: M11.P$1 M15.P$1 Q10.3(D) R41.1
I2C1_SDA: Q14.2(S) R45.1 TP53.P$1 U3.P$93(93.PB7)
I2C1_SDA_VOUT: M11.P$2 M15.P$2 Q14.3(D) R49.1
I2C1_VOUT: JP5.2 M11.P$3 M15.P$3 R41.2 R49.2
I2C2_SCL: U3.P$46(46.PB10)
I2C2_SDA: U3.P$47(47.PB11)
IMU_FSYNC: TP31.P$1 U3.P$64(64.PC7) U6.12(B7)
IMU_FSYNC_VDDIO: U5.11(FSYNC) U6.9(A7)
IMU_INT: TP30.P$1 U3.P$63(63.PC6) U6.11(B8)
IMU_INT_VDDIO: U5.12(INT) U6.10(A8)
IMU_RESV1: JP10.1 U5.1(RESV1)
IMU_VDDIO: C13.1 JP9.2 JP10.2 TP17.P$1 U5.8(VDDIO) U6.5(VCCA) U6.6(OE)
LTS: Q19.2(S) R58.1 TP70.P$1 U3.P$82(82.PD1)
LTS_12V: M19.P$2 M20.P$2 Q19.3(D) R62.1
N$2: J2.SHIELD J2.SHIELD2(SHIELD) J2.SHIELD3(SHIELD) J2.SHIELD4(SHIELD) J2.SHIELD5(SHIELD) J2.SHIELD6(SHIELD) J2.SHIELD7(SHIELD) J2.SHIELD8(SHIELD) J2.SHIELD9(SHIELD) J2.SHIELD10(SHIELD) R10.2
N$3: C11.1 U3.P$73(73.VCAP2)
N$4: J1.SHIELD J1.SHIELD2(SHIELD) J1.SHIELD3(SHIELD) J1.SHIELD4(SHIELD) J1.SHIELD5(SHIELD) J1.SHIELD6(SHIELD) J1.SHIELD7(SHIELD) J1.SHIELD8(SHIELD) J1.SHIELD9(SHIELD) J1.SHIELD10(SHIELD) R1.2
N$5: C10.1 U3.P$48(48.VCAP1)
N$7: Q1.5(Q1:B) R3.1
N$8: Q1.2(Q2:B) R4.1
N$13: C15.1 U5.10(REGOUT)
N$15: D8.C R55.2
N$16: J3.2(SWDIO/TMS) R13.1
N$17: J3.4(SWDCLK/TCK) R14.1
N$19: D6.C R53.2
N$20: D1.C R7.2
N$21: D3.C R8.2
N$22: D12.C R69.2
N$25: D5.C R12.2
N$26: D4.C R11.2
PH0: C7.2 U3.P$12(12.PH0) Y1.3
PH1: C8.2 U3.P$13(13.PH1) Y1.1
QSPI_BK1_IO0: Q9.2(S) R32.1 TP37.P$1 U3.P$58(58.PD11)
QSPI_BK1_IO1: U3.P$59(59.PD12)
QSPI_BK1_IO2: U3.P$1(1.PE2)
QSPI_BK1_IO3: U3.P$60(60.PD13)
QSPI_BK1_NCS: U3.P$92(92.PB6)
QSPI_BK2_IO0: U3.P$37(37.PE7) U9.5(SI(D0))
QSPI_BK2_IO1: U3.P$38(38.PE8) U9.2(SO(D1))
QSPI_BK2_IO2: U3.P$39(39.PE9) U9.3(!WP!(D2))
QSPI_BK2_IO3: U3.P$40(40.PE10) U9.7(!HOLD!(D3))
QSPI_BK2_NCS: U3.P$79(79.PC11) U9.1(!CS!)
QSPI_SCLK: Q5.2(S) R24.1 TP45.P$1 U3.P$36(36.PB2) U9.6(SCK)
REV: Q21.2(S) R60.1 TP72.P$1 U3.P$84(84.PD3)
REV_12V: M19.P$4 M20.P$4 Q21.3(D) R64.1
RTS: Q20.2(S) R59.1 TP71.P$1 U3.P$83(83.PD2)
RTS_12V: M19.P$3 M20.P$3 Q20.3(D) R63.1
SD_CD: M21.CD_SW1 R66.2 TP25.P$1 U3.P$15(15.PC0)
SPI1_MISO: M21.P$7(DAT0) TP21.P$1 U3.P$30(30.PA6) U6.13(B6)
SPI1_MISO_VDDIO: U5.9(AD0/SDO) U6.8(A6)
SPI1_MOSI: M21.P$3(CMD) TP20.P$1 U3.P$88(88.PD7) U6.18(B3)
SPI1_MOSI_VDDIO: U5.24(SDA/SDI) U6.3(A3)
SPI1_SCLK: M21.P$5(CLK) TP22.P$1 U3.P$89(89.PB3) U6.19(B2)
SPI1_SCLK_VDDIO: U5.23(SCL/SCLK) U6.2(A2)
SPI2_MOSI: Q6.2(S) R29.1 TP34.P$1 U3.P$16(16.PC1)
SPI2_SCLK: Q2.2(S) R21.1 TP42.P$1 U3.P$52(52.PB13)
SPI3_MOSI: Q7.2(S) R30.1 TP35.P$1 U3.P$87(87.PD6)
SPI3_SCLK: Q3.2(S) R22.1 TP43.P$1 U3.P$78(78.PC10)
SPI4_MOSI: Q8.2(S) R31.1 TP36.P$1 U3.P$5(5.PE6)
SPI4_SCLK: Q4.2(S) R23.1 TP44.P$1 U3.P$42(42.PE12)
SPI6_MISO: TP8.P$1 U1.31(MISO_V/IO19) U3.P$90(90.PB4)
SPI6_MOSI: TP7.P$1 U1.37(MOSI_V/IO23) U3.P$31(31.PA7)
SPI6_SCLK: TP9.P$1 U1.30(SCK_V/IO18) U3.P$29(29.PA5)
STM_!RESET: C12.2 J3.10(!RESET) R19.1 S4.1 S4.2 TP62.P$1 U3.P$14(14.NRST)
STM_USB_DM: J2.D- U3.P$70(70.PA11)
STM_USB_DP: J2.D+ U3.P$71(71.PA12)
SWCLK: R14.2 R17.1 TP68.P$1 U3.P$76(76.PA14)
SWDIO: R13.2 R18.1 TP78.P$1 U3.P$72(72.PA13)
UART4_RX: U1.28(IO17) U3.P$23(23.PA1)
UART4_TX: U1.27(IO16) U3.P$22(22.PA0)
UART5_RX: U3.P$51(51.PB12)
UART5_TX: U3.P$80(80.PC12)
UART8_RX: U3.P$97(97.PE0)
UART8_TX: U3.P$98(98.PE1)
ULED1: R11.1 U3.P$7(7.PC13)
ULED2: R12.1 U3.P$8(8.PC14)
US1: M1.P$3 M2.P$3 R20.2 S5.1 S5.2 U3.P$85(85.PD4)
US2: M1.P$1 M2.P$1 R16.2 S3.1 S3.2 U3.P$86(86.PD5)
USART1_RX: Q16.2(S) R47.1 R55.1 TP58.P$1 U3.P$54(54.PB15)
USART1_RX_VOUT: M13.P$1 M17.P$1 Q16.3(D) R51.1
USART1_TX: Q12.2(S) R39.1 R53.1 TP57.P$1 U3.P$53(53.PB14)
USART1_TX_VOUT: M13.P$2 M17.P$2 Q12.3(D) R43.1
USART1_VOUT: JP7.2 M13.P$3 M17.P$3 R43.2 R51.2
USB_OTG_FS_ID: J2.ID U3.P$69(69.PA10)
USB_OTG_FS_SOF: U3.P$67(67.PA8)
V_USB: D11.A J1.VBUS J2.VBUS Q23.1(G) R68.2 TP49.P$1 U3.P$68(68.PA9)
VOVP: D10.C F1.2 JP11.2 Q23.3(D) TP48.P$1
VRAW: M22.P$2 M23.P$3 Q22.3(D)
VRPP: F1.1 JP11.1 Q22.2(S) TP47.P$1
Unconnected: D2.5COUT D2.6DOUT J1.ID J3.6(SWO/TDO) J3.7(KEY) J3.8(NC/TDI) M21.P$1(DAT2) M21.P$8(DAT1) U1.4(SENSOR_VP/I36) U1.5(SENSOR_VN/I39) U1.6(IO34) U1.7(IO35) U1.8(XTAL_P/IO32) U1.9(XTAL_N/IO33) U1.10(IO25) U1.11(IO26) U1.12(IO27) U1.14(MISO_H/IO12) U1.17(SHD/IO9) U1.18(SWP/IO10) U1.19(SCS/IO11) U1.20(SCK/IO6) U1.21(SDO/IO7) U1.22(SDI/IO8) U1.23(CS0_H/IO15) U1.26(IO4) U1.32(NC) U1.33(IO21) U1.36(IO22) U3.P$17(17.PC2) U3.P$18(18.PC3) U3.P$24(24.PA2) U3.P$25(25.PA3) U3.P$28(28.PA4) U3.P$32(32.PC4) U3.P$33(33.PC5) U3.P$34(34.PB0) U3.P$35(35.PB1) U3.P$41(41.PE11) U3.P$43(43.PE13) U3.P$44(44.PE14) U3.P$45(45.PE15) U3.P$55(55.PD8) U3.P$56(56.PD9) U3.P$57(57.PD10) U3.P$61(61.PD14) U3.P$62(62.PD15) U3.P$65(65.PC8) U3.P$66(66.PC9) U3.P$77(77.PA15) U3.P$91(91.PB5) U3.P$96(96.PB9) U5.7(AUX_CL) U5.21(AUX_DA) U6.4(A4) U6.7(A5) U6.14(B5) U6.17(B4) U7.4(NC) U8.9(!CTS) U8.10(!DSR) U8.11(!RI) U8.12(!DCD) U8.15(R232)

## Notes on the sheet
- Output Conditioning
- STM32 | SPI1 Devices
- Input Conditioning
- ESP32 | Power Supply
- ICM 20948 : 1.8V
  MPU 9250 : 3.3V
- Connect jumper if using MPU9250
- Completed peripherals
- SPI1
- SPI2 (TX only)
- SPI3 (TX only) | Max input: 6V
- SPI4 (TX only)
- QSPI (BK1)
- SPI6
- UART4
- UART5
- UART7
- UART8
- I2C1
- I2C2

## Library data of the parts
C1 C3 C4 C6 C12-C16 = SparkFun-Capacitors:0.1UF: 0.1µF ceramic capacitors A capacitor is a passive two-terminal electrical component used to store electrical energy temporarily in an electric field.; PROD_ID: CAP-08604
C2 C10 C11 C17 C18 = SparkFun-Capacitors:2.2UF: 2.2µF ceramic capacitors A capacitor is a passive two-terminal electrical component used to store electrical energy temporarily in an electric field.; PROD_ID: CAP-07888
C5 C9 = SparkFun-Capacitors:10UF: 10.0µF ceramic capacitors A capacitor is a passive two-terminal electrical component used to store electrical energy temporarily in an electric field.; PROD_ID: CAP-11015
C7 C8 = SparkFun-Capacitors:18PF: 18pF ceramic capacitors A capacitor is a passive two-terminal electrical component used to store electrical energy temporarily in an electric field.; PROD_ID: CAP-08267
C20 = SparkFun-Capacitors:0.1UF: 0.1µF ceramic capacitors A capacitor is a passive two-terminal electrical component used to store electrical energy temporarily in an electric field.; PROD_ID: CAP-00810
D1 D6 = SparkFun-LED:LED-GREEN: Green SMD LED Used in manufacturing of various products at SparkFun Packages: 0603 - SMD 0603 package [Product Link] <http://www.futureelectronics.com/en/technologies/semiconductors/optoelectronics/leds/Pages/9894312-LTST-C190GKT.aspx?CrossPart=HSMG-C190&IM=0> LilyPad 1206 - SMD1206 LilyPad package [Product Link] <http://www.futureelectronics.com/en/Technologies/Product.aspx?ProductID=IN150NGHARVATEKCORPORATION2049943&IM=0> 1206 - SMD1206 package [Product Link] <http://www.futureelectronics.com/en/technologies/semiconductors/optoelectronics/leds/Pages/8315665-LTST-C150KGKT.aspx?IM=0> 1206 Bottom Mount -SMD 1206 Bottom Mount [Product Link] <http://www.digikey.com/product-detail/en/lite-on-inc/LTST-C230KGKT/160-1456-1-ND/386854> SparkFun Products: Pro Mini 328 -5V <https://www.sparkfun.com/products/821> RedBoard <https://www.sparkfun.com/products/12757> MP3 Trigger <https://www.sparkfun.com/products/13720> Makey Makey <https://www.sparkfun.com/products/11076>; PROD_ID: DIO-00821; VALUE: GREEN
D2 = MTAES_V2_UniqueParts:APA102
D3 D8 = SparkFun-LED:LED-YELLOW: Yellow SMD LED Used in manufacturing several products at SparkFun. Packages: 0603 - SMD 0603 package[Product Link] <http://www.kingbrightusa.com/product.asp?catalog_name=LED&product_id=APT1608SYCK> 0603 -SMART - SMART SMD 0603 package (more efficient/more expensive) [Product Link] <http://www.osram-os.com/osram_os/en/products/product-catalog/led-light-emitting-diodes/smartled-0603/ly-l29k/index.jsp> LilyPad - SMD1206 package[Product Datasheet] <https://www.sparkfun.com/datasheets/DevTools/LilyPad/Q150YUS4.pdf> SparkFun Products: Blynk Board <https://www.sparkfun.com/products/13794> IOIO-OTG <https://www.sparkfun.com/products/13613> XBee Explorer Serial <https://www.sparkfun.com/products/13225>; PROD_ID: DIO-09003; VALUE: Yellow
D4 = SparkFun-LED:LED-BLUE: Blue SMD LED Used in manufacturing of various products at SparkFun Packages: 0603 - SMD 0603 package [Product Link] <http://www.digikey.com/product-detail/en/SMLE12BC7TT86/511-1589-2-ND/1641808> 1206 - SMD1206 package [Product Link] <http://www.digikey.com/product-detail/en/lite-on-inc/LTST-C150TBKT/160-1643-1-ND/573584> SparkFun Products: ESP8266 Thing-Dev Board <https://www.sparkfun.com/products/13711> RedBoard <https://www.sparkfun.com/products/12757>; PROD_ID: DIO-08575; VALUE: BLUE
D5 = SparkFun-LED:LED-WHITE: White SMD LED Used in manufacturing several products at SparkFun. Packages: 0603 - Bright White SMD 0603 package[Product Link] <http://www.kingbrightusa.com/product.asp?catalog_name=LED&product_id=APT1608QWF/D> 1206 - Bright White SMD1206 package [Product Link] <http://www.kingbrightusa.com/product.asp?catalog_name=LED&product_id=APT3216QWF/D> 3014 - Super Bright SMD 3014 package [Datasheet] <http://www.lumileds.com/uploads/459/DS208-pdf> SparkFun Products: Blackberry Trackballer Breakout <https://www.sparkfun.com/products/13169> Digital SandBox <https://www.sparkfun.com/products/12651>; PROD_ID: DIO-09004; VALUE: WHITE
D10 = SparkFun-DiscreteSemi:DIODE-ZENER: Zener Diode A Zener diode allows current to flow from its anode to its cathode like a normal semiconductor diode, but it also permits current to flow in the reverse direction when its "Zener voltage" is reached. - WIkipedia; PROD_ID: DIO-12442
D11 = SparkFun-DiscreteSemi:DIODE-SCHOTTKY: Schottky diode A Schottky diode is a semiconductor diode which has a low forward voltage drop and a very fast switching action.; PROD_ID: DIO-14072
D12 = SparkFun-LED:LED-RED: Red SMD LED Used in manufacturing of most products at SparkFun Packages: 0603 - SMD 0603 package [Product Link] <http://docs.avagotech.com/docs/AV02-0551EN> 0603 SMART - SMD 0603 SMART package ( more efficient and expensive)[Product Link] <http://www.osram-os.com/Graphics/XPic2/00077099_0.pdf> 1206 - SMD1206 package [Product Link] <https://www.sparkfun.com/datasheets/DevTools/LilyPad/Q150OVS4.pdff> SparkFun Products: Pro Mini 328 -5V <https://www.sparkfun.com/products/821> RedBoard <https://www.sparkfun.com/products/12757> IOIO-OTG <https://www.sparkfun.com/products/13613>; PROD_ID: DIO-00819; VALUE: RED
F1 = SparkFun-Fuses:PPTC: Resettable Fuse PPTC Resettable Fuse. Really a sort of resistor with a polymeric positive temperature coefficient whose resistance increases dramatically with an increase in temperature. When heated by the power passing through the resistance rises causing the current to be limited, protecting the circuit. This is achieved by the transition of the polymer from a crystalline to an amorphous state where the conductive carbon separates breaking the conductive pathways found in the cool crystalline structure. When a PPTC cools back down it resumes conducting letting the circuit turn back on. SparkFun Products: SparkFun RedBoard - Programmed with Arduino <https://www.sparkfun.com/products/12757> Pro Micro - 5V/16MHz <https://www.sparkfun.com/products/12640> Arduino Pro 328 - 5V/16MHz <https://www.sparkfun.com/products/10915> MP3 Trigger <https://www.sparkfun.com/products/13720>
FD1-FD4 = SparkFun-Aesthetics:FIDUCIAL: Fiducial Alignment Points Point-of-reference for pick-and-place machines and other optical instruments.
H1-H4 = SparkFun-Hardware:STAND-OFF: Stand Off Drill holes for mechanically mounting via screws, standoffs, etc. Note: Use the keepout ring to avoid running the screw head into surrounding components. Variant Overviews STAND-OFF - Mechanical footprint for a #4 phillips button head screw. STAND-OFF-TIGHT - Mechanical footprint for a #4 phillips button head screw, Example SparkFun Products Screw - Phillips Head (1/4", 4-40, 10 pack) <https://www.sparkfun.com/products/10453> (PRT-10453) Screw - Phillips Head (1/2", 4-40, 10 pack) <https://www.sparkfun.com/products/10452> (PRT-10452) Screw - Phillips Head (3/4", 4-40, 10 pack) <https://www.sparkfun.com/products/10451> (PRT-10451) Screw - Phillips Head (1", 4-40, 10 pack) <https://www.sparkfun.com/products/10450> (PRT-10450)
J1 J2 = SparkFun-Connectors:USB_MICRO-B: USB Type Micro-B Connector Male/female and PTH/SMT variants SparkFun Products: SparkFun microB USB Breakout <https://www.sparkfun.com/products/12035> SparkFun USB microB Plug Breakout <https://www.sparkfun.com/products/10031> SparkFun ESP8266 Thing <https://www.sparkfun.com/products/13231>; PROD_ID: CONN-13711
J3 = SparkFun-Connectors:CORTEX_DEBUG: Cortex Debug Connector - 10 pin Supports JTAG debug, Serial Wire debug, and Serial Wire Viewer. PTH and SMD connector options available. General Connector Information <http://infocenter.arm.com/help/topic/com.arm.doc.faqs/attached/13634/cortex_debug_connectors.pdf> Products: PTH Connector <http://www.digikey.com/product-detail/en/cnc-tech/3220-10-0100-00/1175-1627-ND/3883661> -via Digi-Key SparkFun PSoc <https://www.sparkfun.com/products/13229> SparkFun T <https://www.sparkfun.com/products/13810>
JP1-JP5 JP7 JP9 = SparkFun-Jumpers:JUMPER-SMT_3_1-NC_TRACE: Normally closed trace jumper (1 of 2 connections) This jumper has a trace between two pads so it's normally closed (NC). The other connection is normally open (NO). Use a razor knife to open the connection. For best results follow the IPC guidelines for cutting traces: Cutout at least 0.063 mm (0.005 in). Remove all loose material to clean up the cut area. Seal the cut with an approved epoxy. Reapply solder to reclose the connection, or to close the NO connection.
JP6 JP10 JP11 = SparkFun-Jumpers:JUMPER-SMT_2_NO: Normally open jumper This jumper has two pads in close proximity to each other. Apply solder to close the connection. Round pads are easier to solder for beginners, but are a lot larger. SparkFun Product that uses the round pads: SparkFun EL Sequencer <https://www.sparkfun.com/products/12781>
M1 M7-M10 = MTAES_V2_UniqueParts:CONN_SMD_3
M2-M6 = MTAES_V2_UniqueParts:CONN_LED_OUT
M11 M13 M19 = MTAES_V2_UniqueParts:CONN_LOCK_4
M15 M17 M20 = MTAES_V2_UniqueParts:CONN_SMD_4
M21 = MTAES_V2_UniqueParts:SD_MICRO_SOCKET
M22 = MTAES_V2_UniqueParts:CONN_SMD_2
M23 = MTAES_V2_UniqueParts:CONN_LOCK_2
Q1 = SparkFun-DiscreteSemi:TRANS_NPN_DUAL: Dual NPN Transistors in Single Package The MBT3904W1 puts two general purpose 3904 NPN transistors in a single package. Datasheet <http://www.onsemi.com/pub_link/Collateral/MBT3904DW1T1-D.PDF> SparkFun Products: SparkFun ESP32 Thing <https://www.sparkfun.com/products/13907>; PROD_ID: TRANS-13337
Q2-Q10 Q12 Q14 Q16 Q18-Q21 = MTAES_V2_UniqueParts:AMP_MOSFET_NCH
Q22 Q23 = SparkFun-DiscreteSemi:MOSFET_PCH: P-channel MOSFETs Voltage controlled devices that allow control of high current outputs. SparkFun Products: SparkFun ESP32 Thing <https://www.sparkfun.com/products/13907> SparkFun ESP8266 Thing <https://www.sparkfun.com/products/13231>; PROD_ID: TRANS-11153
R1 R10 = SparkFun-Resistors:1MOHM: 1MΩ resistor A resistor is a passive two-terminal electrical component that implements electrical resistance as a circuit element. Resistors act to reduce current flow, and, at the same time, act to lower voltage levels within circuits. - Wikipedia; PROD_ID: RES-07868; VALUE: 1M
R3 R4 R6 R9 R16-R36 R38 R39 R43 R47 R51 R57-R68 = SparkFun-Resistors:10KOHM: 10kΩ resistor A resistor is a passive two-terminal electrical component that implements electrical resistance as a circuit element. Resistors act to reduce current flow, and, at the same time, act to lower voltage levels within circuits. - Wikipedia; PROD_ID: RES-00824
R7 R8 R11 R12 R53 R55 R69 = SparkFun-Resistors:1KOHM: 1kΩ resistor A resistor is a passive two-terminal electrical component that implements electrical resistance as a circuit element. Resistors act to reduce current flow, and, at the same time, act to lower voltage levels within circuits. - Wikipedia; PROD_ID: RES-07856
R13 R14 = SparkFun-Resistors:20OHM: RES-07862; PROD_ID: RES-07862
R37 R41 R45 R49 = SparkFun-Resistors:2.2KOHM: 2.2kΩ resistor A resistor is a passive two-terminal electrical component that implements electrical resistance as a circuit element. Resistors act to reduce current flow, and, at the same time, act to lower voltage levels within circuits. - Wikipedia; PROD_ID: RES-08272
S1-S5 = SparkFun-Switches:MOMENTARY-SWITCH-SPST: Momentary Switch (Pushbutton) - SPST Normally-open (NO) SPST momentary switches (buttons, pushbuttons). Variants PTH-12MM - 12mm square, through-hole Momentary Pushbutton Switch - 12mm Square <https://www.sparkfun.com/products/9190> (COM-09190) PTH-6.0MM, PTH-6.0MM-KIT - 6.0mm square, through-hole Mini Pushbutton Switch <https://www.sparkfun.com/products/97> (COM-00097) KIT package intended for soldering kit's - only one side of pads' copper is exposed. PTH-RIGHT-ANGLE-KIT - Right-angle, through-hole Right Angle Tactile Button <https://www.sparkfun.com/products/10791> - Used on SparkFun BigTime Watch Kit <https://www.sparkfun.com/products/11734> SMD-12MM - 12mm square, surface-mount Tactile Button - SMD (12mm) <https://www.sparkfun.com/products/12993> (COM-12993) Used on SparkFun PicoBoard <https://www.sparkfun.com/products/11888> SMD-4.5MM - 4.5mm Square Trackball Switch Used on SparkFun Blackberry Trackballer Breakout <https://www.sparkfun.com/products/13169> SMD-4.6MMX2.8MM - 4.60mm x 2.80mm, surface mount Used on SparkFun SAMD21 Mini Breakout <https://www.sparkfun.com/products/13664> SMD-5.2MM, SMD-5.2-REDUNDANT - 5.2mm square, surface-mount Mini Pushbutton Switch - SMD <https://www.sparkfun.com/products/8720> (COM-08720) Used on Arduino Pro Mini <https://www.sparkfun.com/products/11114> REDUNDANT package connects both switch circuits together SMD-6.0X3.5MM - 6.0 x 3.5mm, surface mount Momentary Reset Switch SMD <https://www.sparkfun.com/products/8229> (COM-08229) SMD-6.2MM-TALL - 6.2mm square, surface mount Tactile Button - SMD (6mm) <https://www.sparkfun.com/products/12992> Used on SparkFun Digital Sandbox <https://www.sparkfun.com/products/12651> SMD-RIGHT-ANGLE - Right-angle, surface mount Used on SparkFun Block for Intel® Edison - Arduino <https://www.sparkfun.com/products/13036>; PROD_ID: SWCH-08247; SF_SKU: COM-08720
TP1 TP3-TP13 TP17 TP18 TP20-TP25 TP29-TP31 TP34-TP45 TP47-TP54 TP57 TP58 TP62 TP68-TP72 TP78 = SparkFun-Connectors:TEST-POINT: SparkFun Test Points Bare copper test points for troubleshooting or In-Circuit-Testing. These are used by our Production team for verifying production board runs using pogo-pins on test beds. SparkFun Products: SparkFun LSM9DS1 Breakout <https://www.sparkfun.com/products/13284> SparkFun PSOC <https://www.sparkfun.com/products/13714> SparkFun Load Cell Amplifier <https://www.sparkfun.com/products/13879>
U1 = SparkFun-RF:ESP-WROOM-32; PROD_ID: IC-13849
U3 = MTAES_V2_UniqueParts:STM32F765VTG6
U4 = MTAES_V2_UniqueParts:VREG_1.8_TPS78218DDCR; MANUFACTURER_PART_NUMBER: TPS78218DDCR; VENDOR: Texas Instruments
U5 = MTAES_V2_UniqueParts:IMU_MPU9250-ICM20948: MPU-9250 9 Degree of Freedom IMU System in Package that contains MPU-6500 & AK8963 NC pin 19. 2-6 & 14-17 not internally connected. May be used for PCB trace routing. Datasheet <https://cdn.sparkfun.com/assets/learn_tutorials/5/5/0/MPU9250REV1.0.pdf> SparkFun Products: SparkFun 9DoF Razor IMU M0 <https://www.sparkfun.com/products/14001> SparkFun IMU Breakout - MPU-9250 <https://www.sparkfun.com/products/13762>; PROD_ID: IC-13192
U6 = SparkFun-IC-Comms:TXB0108: 8-Bit Bi-Directional Level Shifter 1.2V-3.6V (VCCA) to 1.65V-5.5V (VCCB) bi-directional level shifter with auto direction sensing. Max data rate - VCCA 1.2V: 20Mbps (50ns), VCCA 3.3V: 100Mbps (10ns) Digikey: 296-27217-1-ND (20-UFDFN) SparkFun Products SparkFun GPS Logger Shield <https://www.sparkfun.com/products/13750> (GPS-13750) SparkFun Block for Intel® Edison - microSD <https://www.sparkfun.com/products/13041> (DEV-13041) SparkFun Block for Intel® Edison - Dual H-Bridge <https://www.sparkfun.com/products/13043> (DEV-13043) SparkFun Block for Intel® Edison - GPIO <https://www.sparkfun.com/products/13038> (DEV-13038) SparkFun Block for Intel® Edison - Raspberry Pi B <https://www.sparkfun.com/products/13044> (DEV-13044); PROD_ID: IC-12292
U7 = SparkFun-IC-Power:V_REG_AP2112: AP2112 - 600mA CMOS LDO Regulator w/ Enable The AP2112 is CMOS process low dropout linear regulator with enable function, the regulator delivers a guaranteed 600mA (min.) continuous load current. Features Output Voltage Accuracy: ±1.5% Output Current: 600mA (Min.) Foldback Short Current Protection: 50mA Enable Function to Turn ON/OFF VOUT Low Dropout Voltage (3.3V): 250mV (Typ.) @IOUT=600mA Excellent Load Regulation: 0.2%/A (Typ.) Excellent Line Regulation: 0.02%/V (Typ.) Low Quiescent Current: 55μA (Typ.) Low Standby Current: 0.01μA (Typ.) Low Output Noise: 50μVRMS PSRR: 100Hz -65dB, 1kHz -65dB OTSD Protection Stable with 1.0μF Flexible Cap: Ceramic, Tantalum and Aluminum Electrolytic Operation Temperature Range: -40°C to 85°C ESD: MM 400V, HBM 4000V; PROD_ID: VREG-12457
U8 = SparkFun-IC-Comms:CH340C; PROD_ID: IC-14038
U9 = SparkFun-DigitalIC:W25Q32FV: Winbond W25Q32FV 32Mbit (4MB) Flash The W25Q32FV support the standard Serial Peripheral Interface (SPI), Dual/Quad I/O SPI as well as 2-clocks instruction cycle Quad Peripheral Interface (QPI). Datasheet <http://www.winbond.com/resource-files/w25q32fv%20revh%20091613.pdf>; PROD_ID: IC-13229
U$98 = MTAES_V2_UniqueParts:REV_NUM; DESIGNER: Owen Lyke; REV: v2.0.1
Y1 = MTAES_V2_UniqueParts:CRYSTAL-24MHZ: 24MHz Crystal Datasheet <http://www.sparkfun.com/datasheets/Components/AT-SMD-5x3.pdf> Frequency: 24MHz Frequency Tolerance: ±20ppm Load Capacitance: 12pF SparkFun Products: USB Bit Whacker <https://www.sparkfun.com/products/762>